# Altium project iMX53_BB_PCB_V1I1.PrjPcb (part 1 of 2)
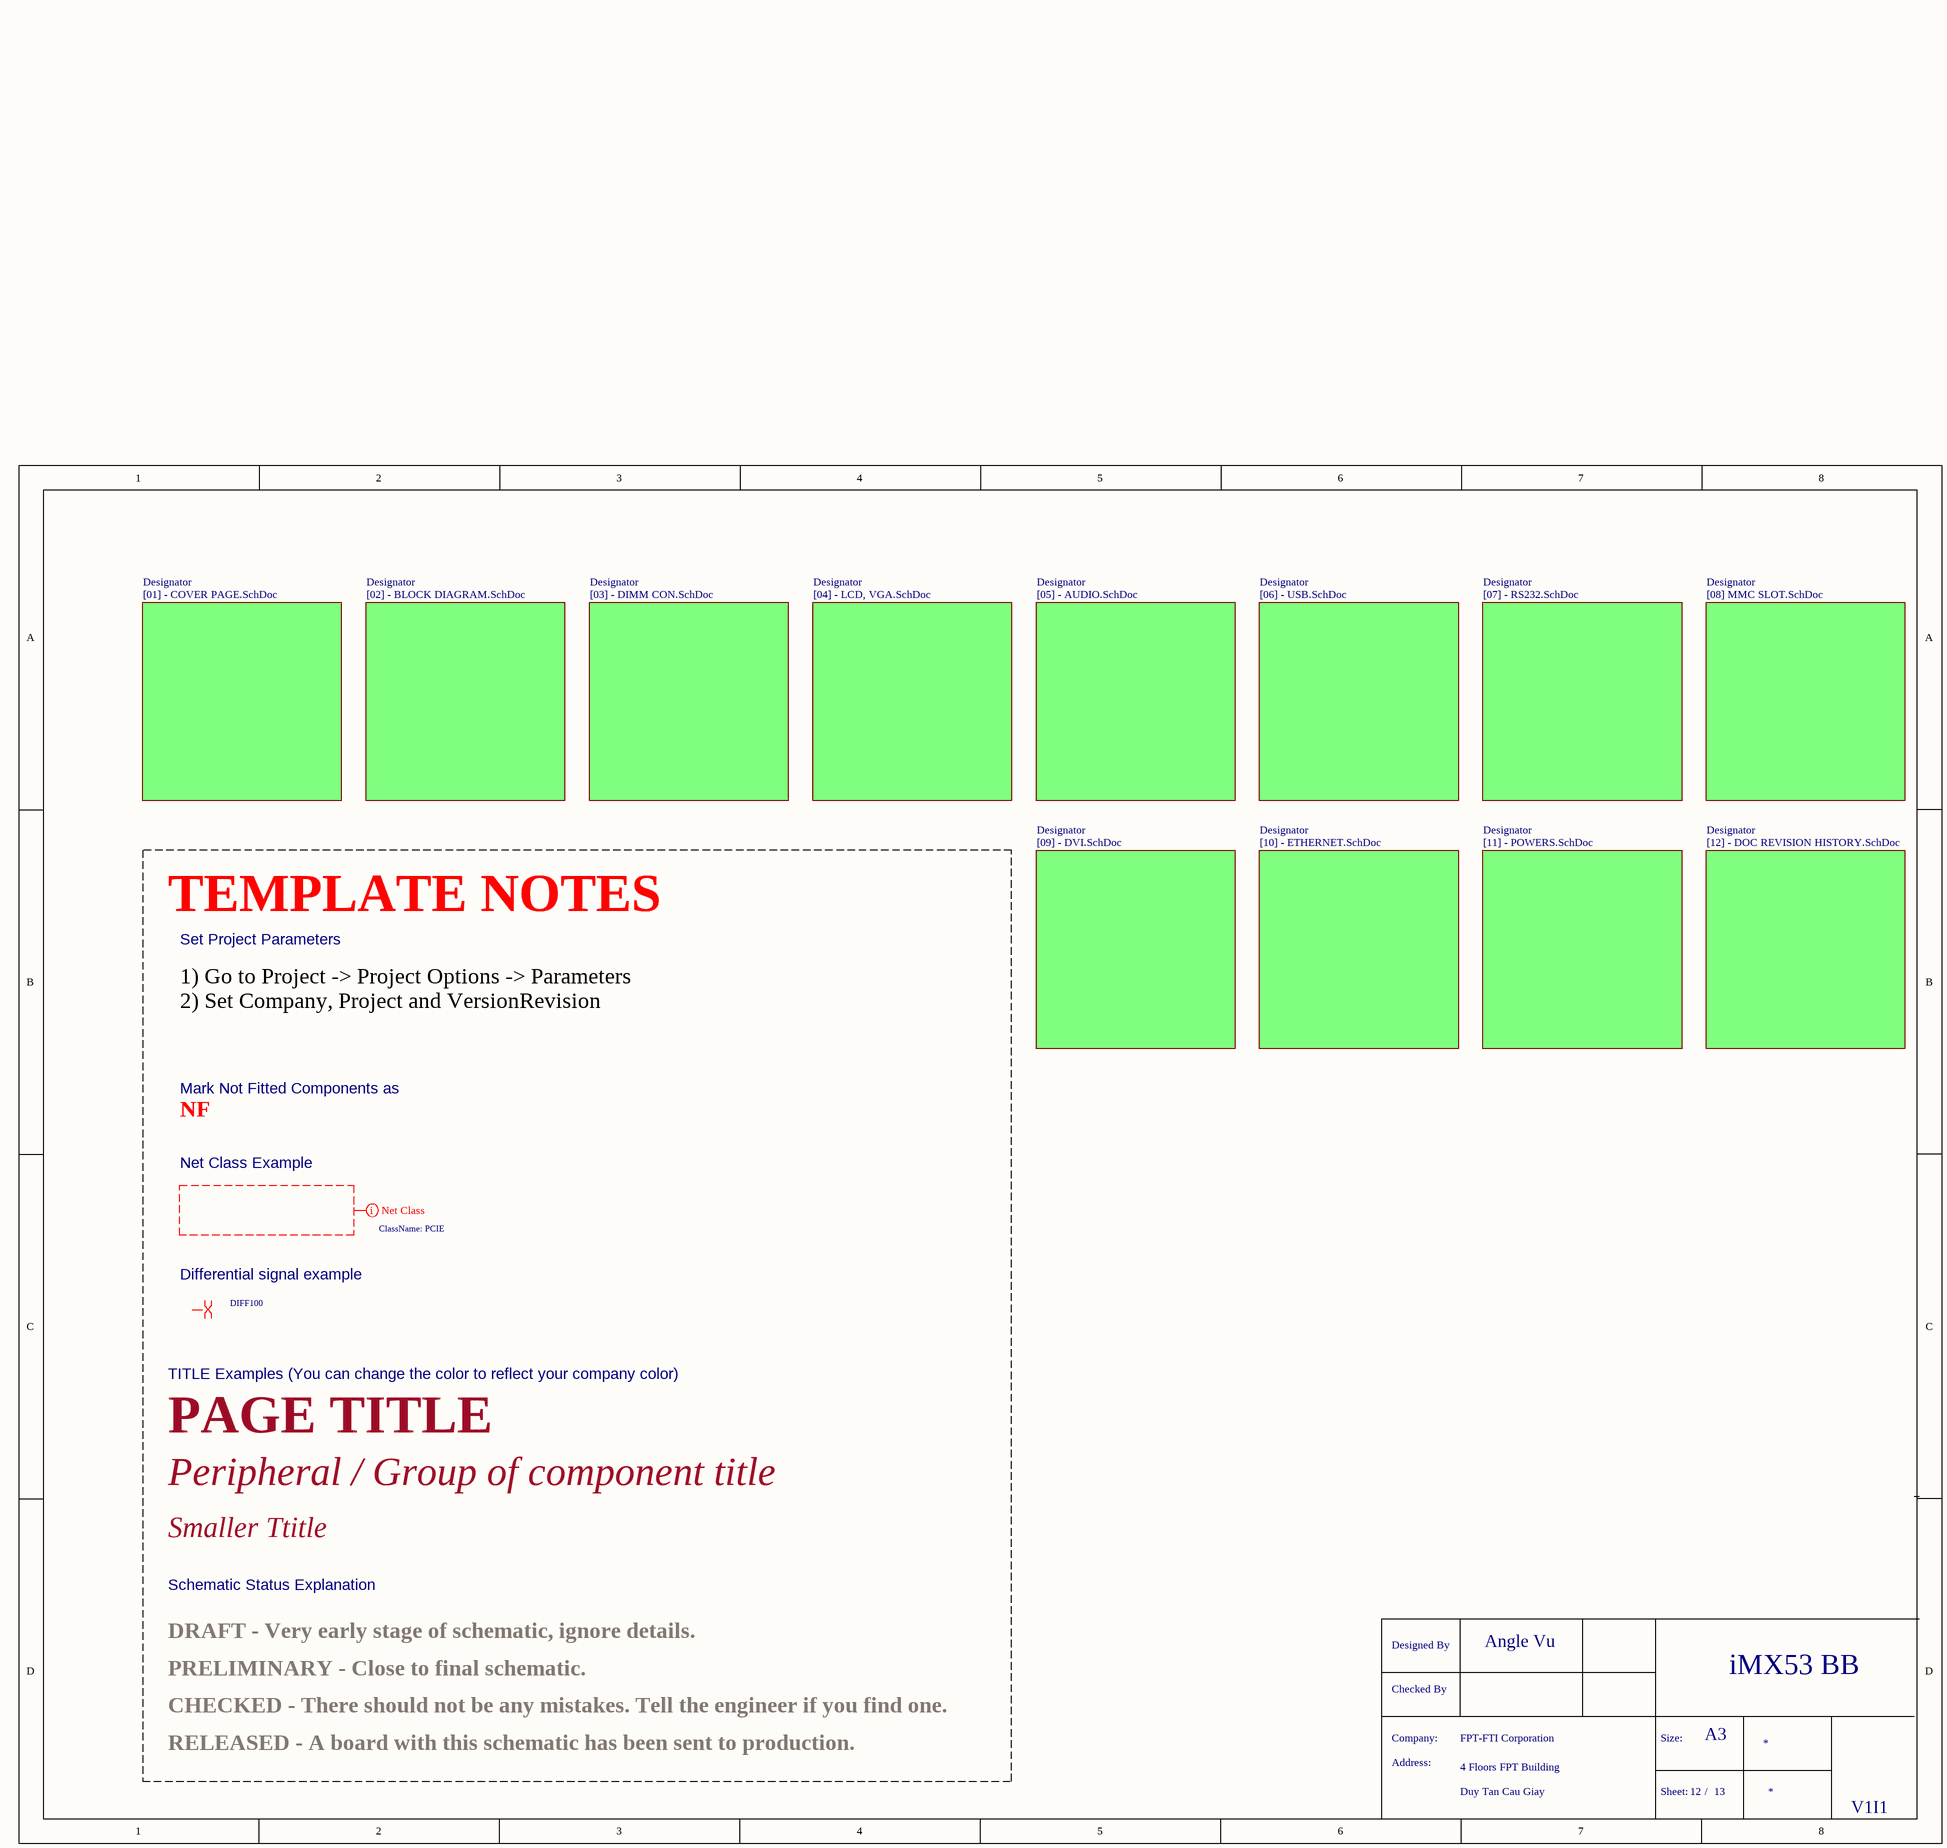
[diagram p0: iMX53 Base Board Project.SchDoc]
Version: V1I1; NameTitle: iMX53 BB; Company: (c) 2013 FEDEVEL www.fedevel.com; CName: FPT-FTI Corporation; addressName2: Duy Tan Cau Giay; addressName1: 4 Floors FPT Building
13 sheets, 582 parts. Net scope: flat (ports and power ports of the same name join across sheets).
Board file: iMX53_BB_PCB_V1I1.PcbDoc
Sheets:
  iMX53 Base Board Project.SchDoc
    Designator = [01] - COVER PAGE.SchDoc
    Designator = [02] - BLOCK DIAGRAM.SchDoc
    Designator = [03] - DIMM CON.SchDoc
    Designator = [04] - LCD, VGA.SchDoc
    Designator = [05] - AUDIO.SchDoc
    Designator = [06] - USB.SchDoc
    Designator = [07] - RS232.SchDoc
    Designator = [08] MMC SLOT.SchDoc
    Designator = [09] - DVI.SchDoc
    Designator = [10] - ETHERNET.SchDoc
    Designator = [11] - POWERS.SchDoc
    Designator = [12] - DOC REVISION HISTORY.SchDoc

## Sheet iMX53 Base Board Project.SchDoc
size A3; PageSetup: Record=PageOptions|CenterHorizontal=True|CenterVertical=True|PrintScale=1.07|XCorrection=1.00|YCorrection=1.00|PrintKind=1|BorderSize=5000000|LeftOffset=0|BottomOffset=0|Orientation=2|PaperLength=1000|PaperWidth=1000|Scale=100|PaperSource=7|PrintQuality=600|MediaType=1|DitherType=10|PaperKind=A3|PrintScaleMode=1; CompanyName: FPT-FTI copporation; Address1: FPT Building Duy Tan; Address2: Floor 4,; DocumentNumber: 12; SheetNumber: 12; SheetTotal: 13; NameAuthor: Angle Vu

### Sub-sheets
Designator = [01] - COVER PAGE.SchDoc: no entries
Designator = [02] - BLOCK DIAGRAM.SchDoc: no entries
Designator = [03] - DIMM CON.SchDoc: no entries
Designator = [04] - LCD, VGA.SchDoc: no entries
Designator = [05] - AUDIO.SchDoc: no entries
Designator = [06] - USB.SchDoc: no entries
Designator = [07] - RS232.SchDoc: no entries
Designator = [08] MMC SLOT.SchDoc: no entries
Designator = [09] - DVI.SchDoc: no entries
Designator = [10] - ETHERNET.SchDoc: no entries
Designator = [11] - POWERS.SchDoc: no entries
Designator = [12] - DOC REVISION HISTORY.SchDoc: no entries

### Layout directives
net class PCIE: (no net found under the mark)
differential pair; net class DIFF100: (no net found under the mark)

### Notes on the sheet
- TEMPLATE NOTES
- Set Project Parameters
- 1) Go to Project -> Project Options -> Parameters
  2) Set Company, Project and VersionRevision
- NF
- Mark Not Fitted Components as
- Net Class Example
- Differential signal example
- TITLE Examples (You can change the color to reflect your company color)
- PAGE TITLE
- Peripheral / Group of component title
- Smaller Ttitle
- Schematic Status Explanation
- PRELIMINARY - Close to final schematic.
- DRAFT - Very early stage of schematic, ignore details.
- CHECKED - There should not be any mistakes. Tell the engineer if you find one.
- RELEASED - A board with this schematic has been sent to production.
- Designed By
- Checked By
- Company:
- Size:
- A3
- Address:
- Sheet:
- /

## Sheet [01] - COVER PAGE.SchDoc
size A3; CompanyName: FPT-FTI copporation; Address1: FPT Building Duy Tan; Address2: Floor 4,; DocumentNumber: 1; SheetNumber: 1; SheetTotal: 13; NameAuthor: Angle Vu
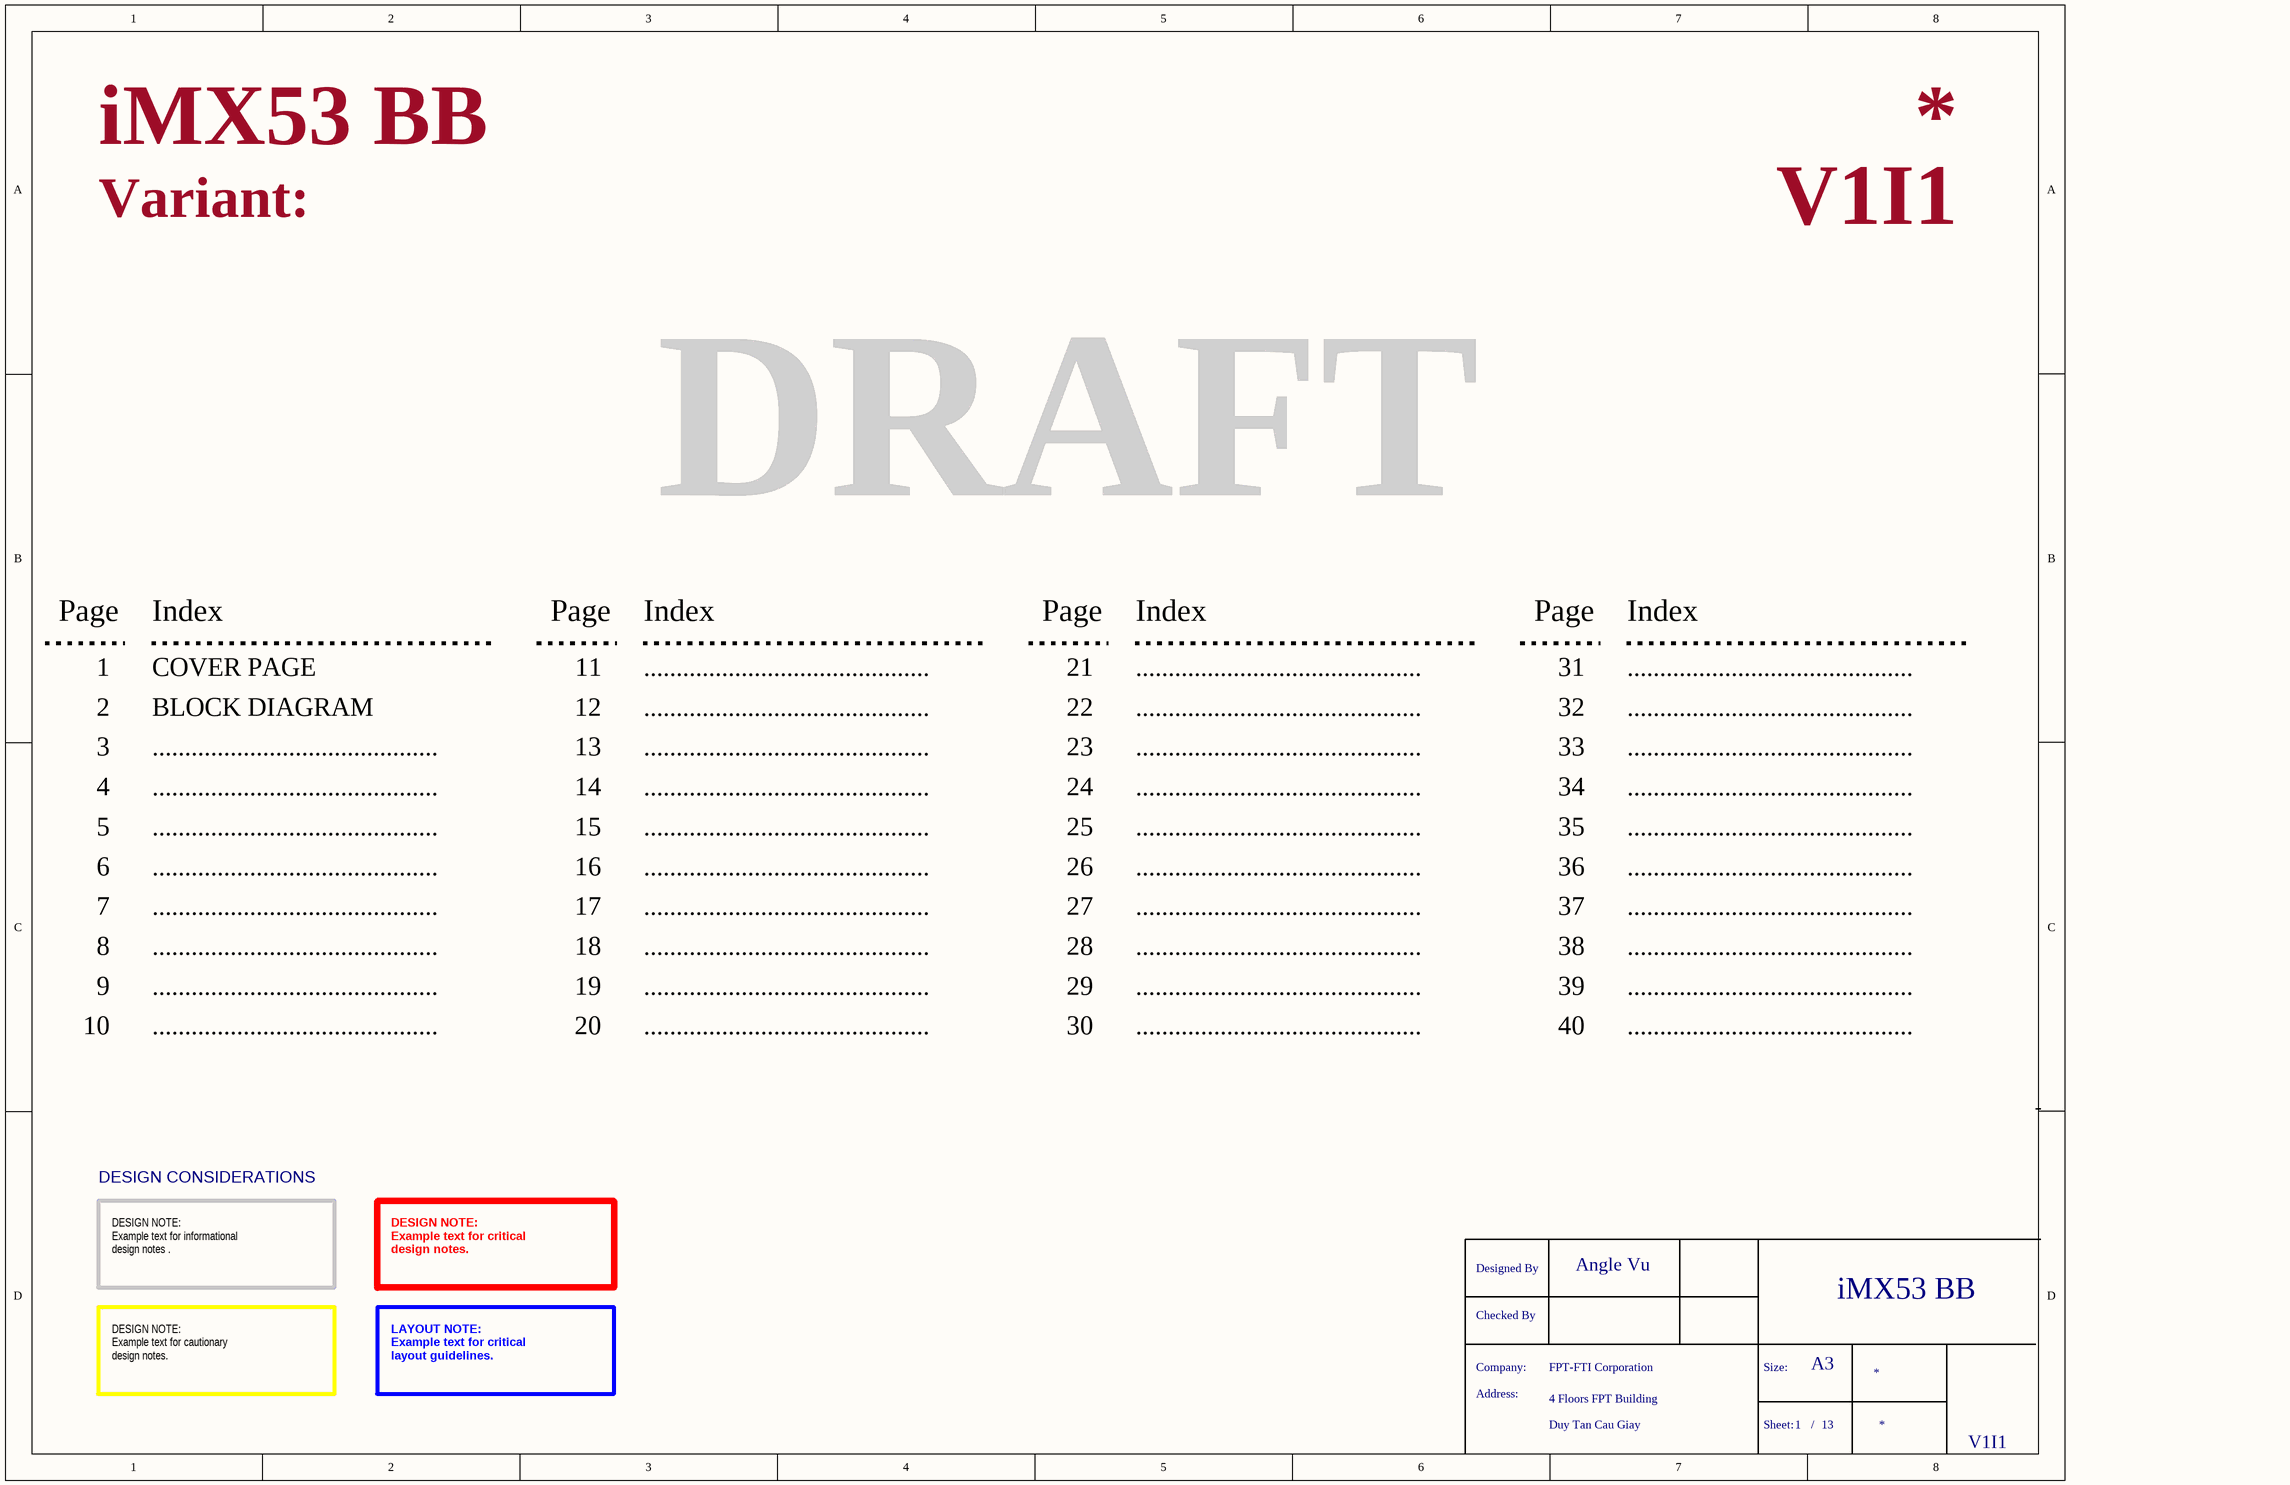
[diagram p1: [01] - COVER PAGE.SchDoc]

### Notes on the sheet
- Variant:
- DRAFT
- Page
- Index
- 1
- COVER PAGE
- 11
- ............................................
- 21
- 31
- 2
- 3
- BLOCK DIAGRAM
- 12
- 13
- 22
- 23
- 32
- 33
- 4
- 5
- 14
- 15
- 24
- 25
- 34
- 35
- 6
- 16
- 26
- 36
- 7
- 8
- 17
- 18
- 27
- 28
- 37
- 38
- 9
- 10
- 19
- 20
- 29
- 30
- 39
- 40
- DESIGN CONSIDERATIONS
- DESIGN NOTE:
  Example text for informational
  design notes .
- DESIGN NOTE:
  Example text for critical
  design notes.
- DESIGN NOTE:
  Example text for cautionary
  design notes.
- LAYOUT NOTE:
  Example text for critical
  layout guidelines.
- Designed By
- Checked By
- Company:
- Size:
- A3
- Address:
- Sheet:
- /

## Sheet [02] - BLOCK DIAGRAM.SchDoc
size A3; CompanyName: FPT-FTI copporation; Address1: FPT Building Duy Tan; Address2: Floor 4,; DocumentNumber: 2; SheetNumber: 2; SheetTotal: 13; NameAuthor: Angle Vu
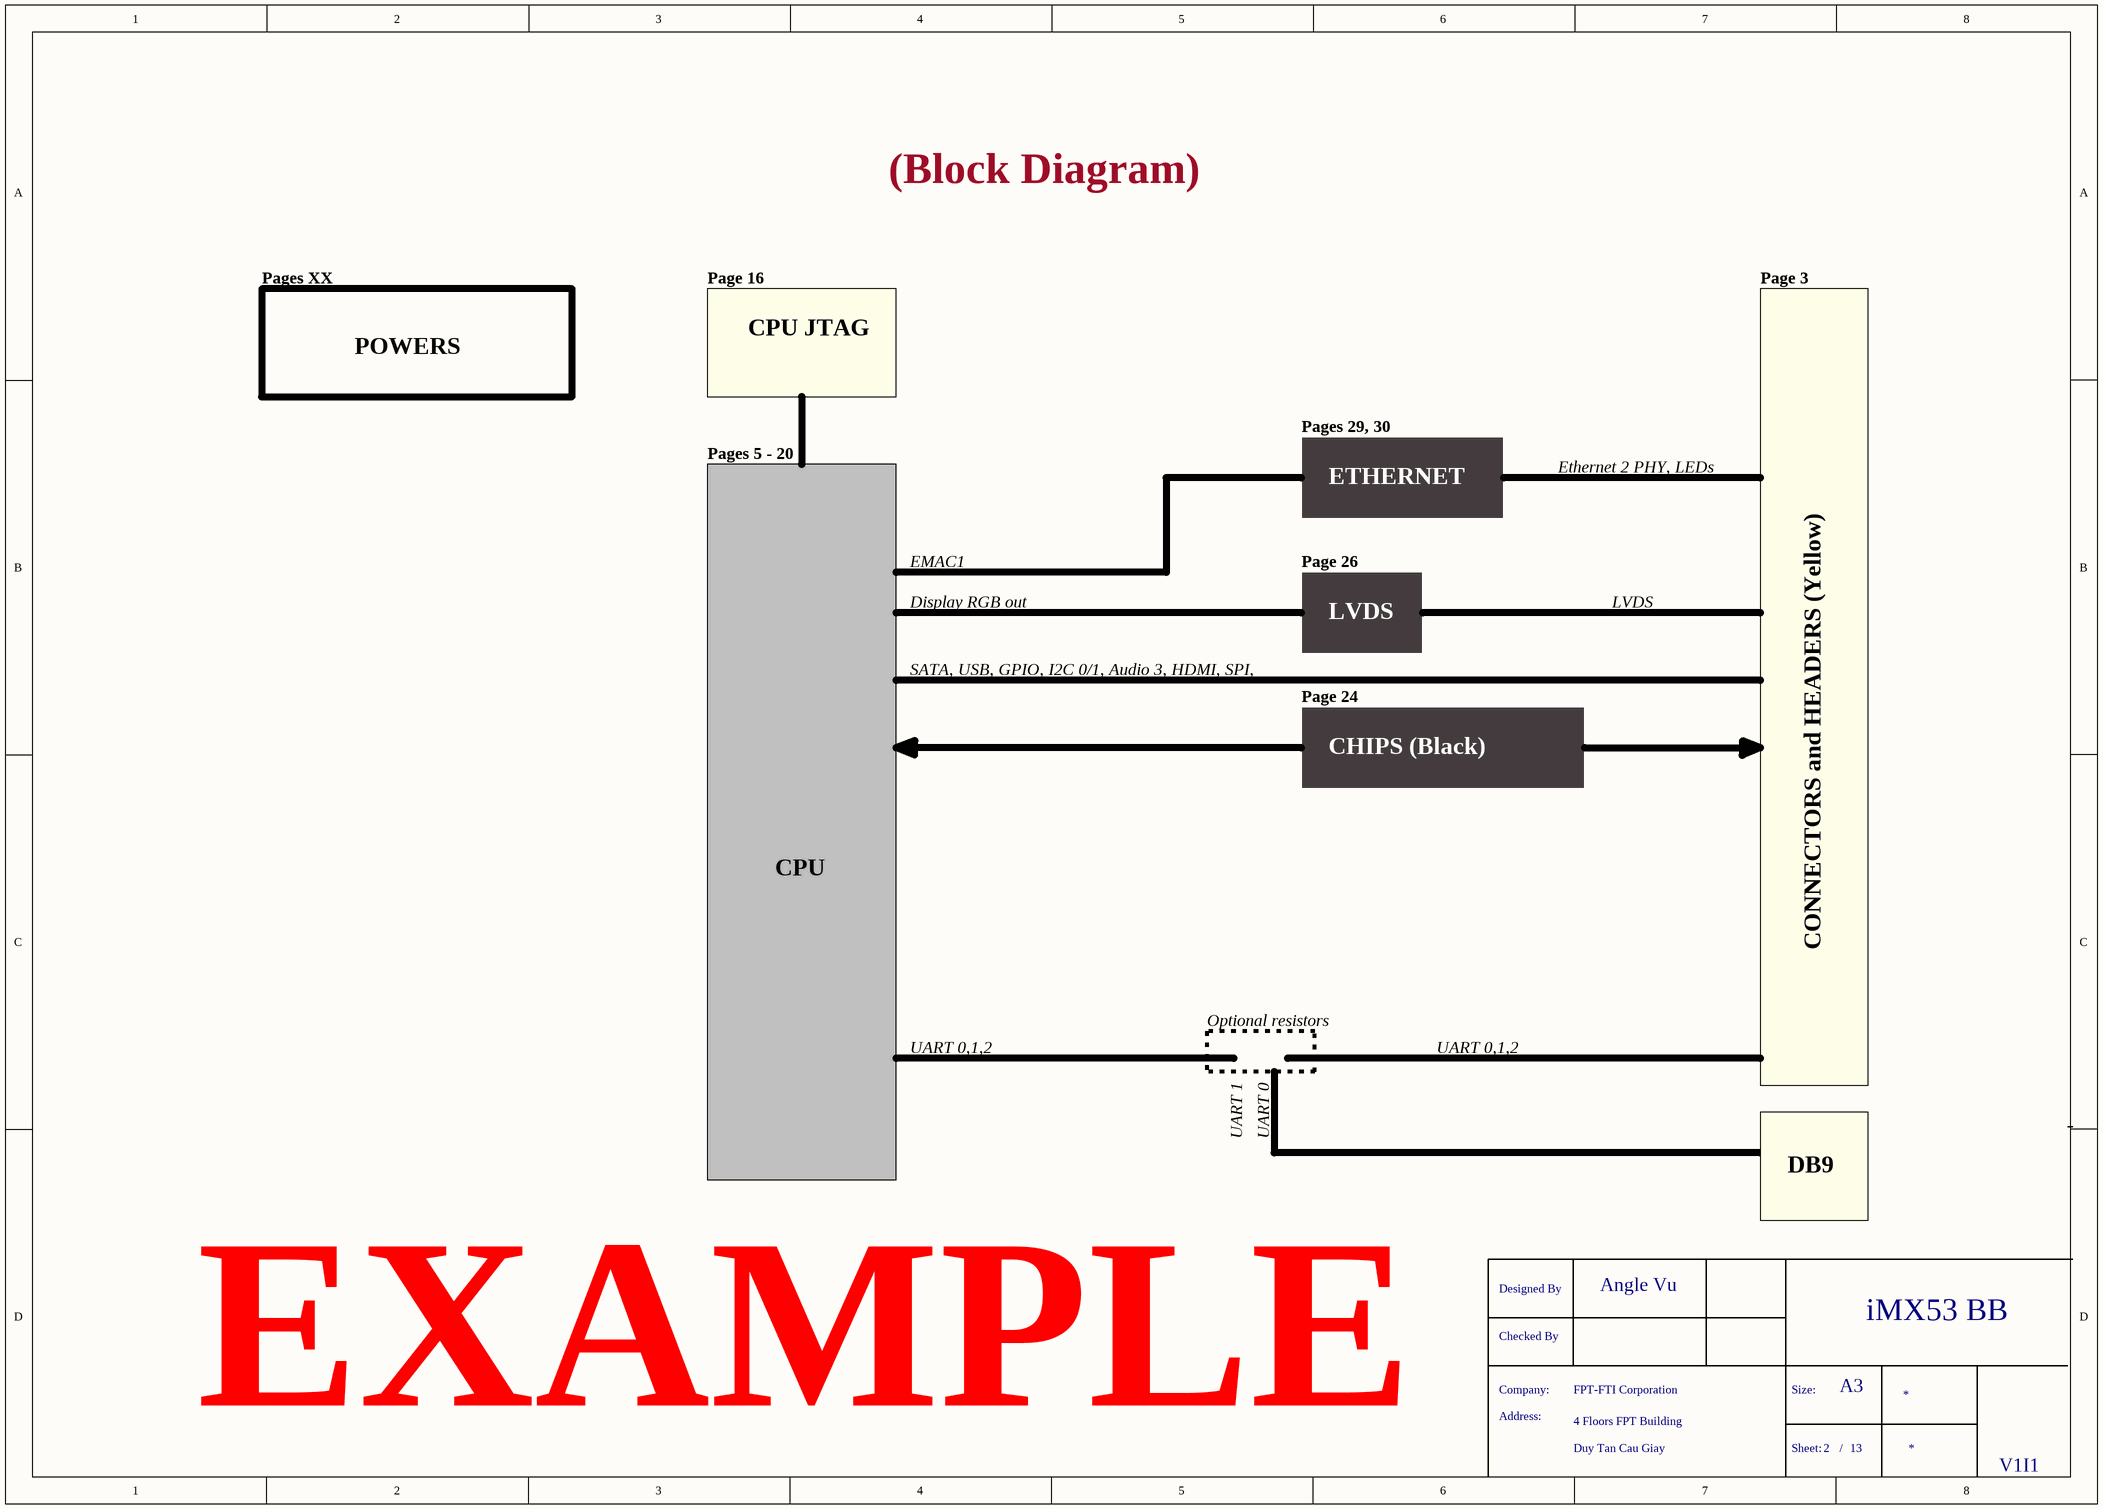
[diagram p2: [02] - BLOCK DIAGRAM.SchDoc]

### Notes on the sheet
- (Block Diagram)
- Pages XX
- Page 16
- Page 3
- POWERS
- CPU JTAG
- Pages 29, 30
- Pages 5 - 20
- ETHERNET
- Ethernet 2 PHY, LEDs
- EMAC1
- Page 26
- Display RGB out
- LVDS
- SATA, USB, GPIO, I2C 0/1, Audio 3, HDMI, SPI,
- Page 24
- CHIPS (Black)
- CPU
- CONNECTORS and HEADERS (Yellow)
- UART 0,1,2
- Optional resistors
- FPGA
- UART 1
- UART 0
- DB9
- CLOCKS (CPU & PCIE)
- EXAMPLE
- Designed By
- Checked By
- Company:
- Size:
- A3
- Address:
- Sheet:
- /

## Sheet [03] - DIMM CON.SchDoc
size A3; CompanyName: FPT-FTI copporation; Address1: FPT Building Duy Tan; Address2: Floor 4,; DocumentNumber: 3; SheetNumber: 3; SheetTotal: 13; NameAuthor: Angle Vu
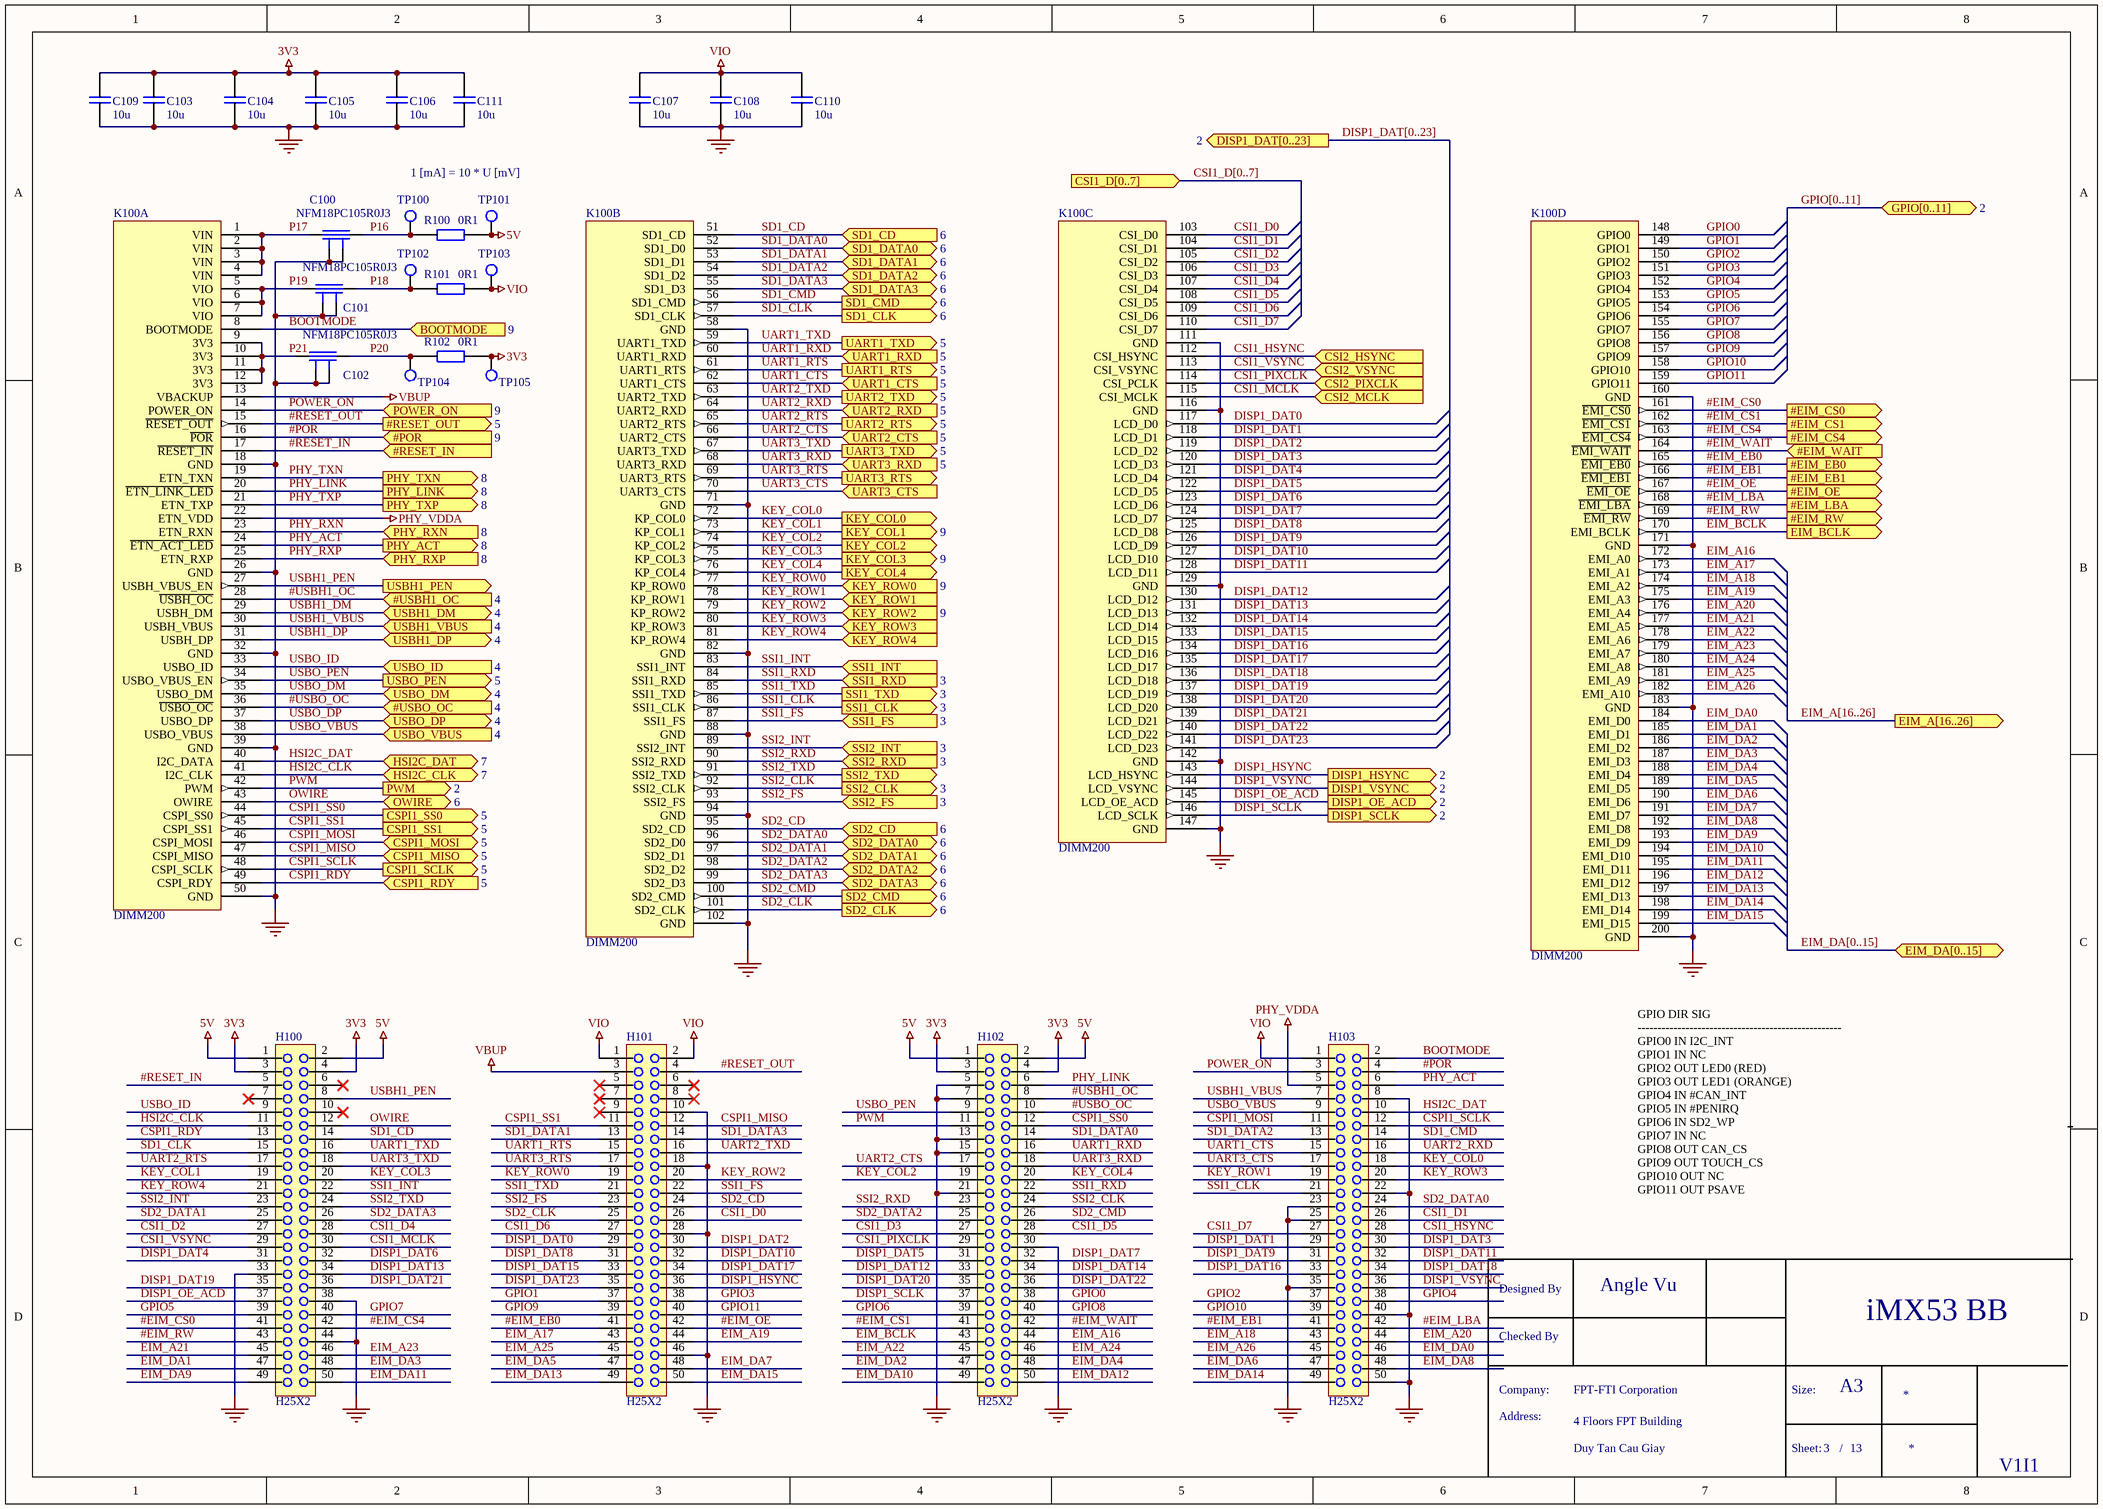
[diagram p3: [03] - DIMM CON.SchDoc]

### Parts
C100  NFM18PC105R0J3  [NFM18P]
C101  NFM18PC105R0J3  [NFM18P]
C102  NFM18PC105R0J3  [NFM18P]
C103  10u  [0805]
C104  10u  [0805]
C105  10u  [0805]
C106  10u  [0805]
C107  10u  [0805]
C108  10u  [0805]
C109  10u  [0805]
C110  10u  [0805]
C111  10u  [0805]
H100  H25X2  [H2x25]
H101  H25X2  [H2x25]
H102  H25X2  [H2x25]
H103  H25X2  [H2x25]
K100  DIMM200  [SODIMM200EDGE]  (parts A,B,C,D of 4)
R100  0R1  [0603]
R101  0R1  [0603]
R102  0R1  [0603]
TP100  TESTPOINT  [TESTPOINT_2mm]  (value not drawn)
TP101  TESTPOINT  [TESTPOINT_2mm]  (value not drawn)
TP102  TESTPOINT  [TESTPOINT_2mm]  (value not drawn)
TP103  TESTPOINT  [TESTPOINT_2mm]  (value not drawn)
TP104  TESTPOINT  [TESTPOINT_2mm]  (value not drawn)
TP105  TESTPOINT  [TESTPOINT_2mm]  (value not drawn)

### Ports
#EIM_CS0 (out), #EIM_CS1 (out), #EIM_CS4 (out), #EIM_EB0 (out), #EIM_EB1 (out), #EIM_LBA (out), #EIM_OE (out), #EIM_RW (out), #EIM_WAIT (in), #POR (in, see 9), #RESET_IN (in), #RESET_OUT (out, see 5), #USBH1_OC (in, see 4), #USBO_OC (in, see 4), BOOTMODE (in, see 9), CSI1_D[0..7] (in), CSI2_HSYNC (in), CSI2_MCLK (in), CSI2_PIXCLK (in), CSI2_VSYNC (in), CSPI1_MISO (bidir, see 5), CSPI1_MOSI (bidir, see 5), CSPI1_RDY (in, see 5), CSPI1_SCLK (out, see 5), CSPI1_SS0 (out, see 5), CSPI1_SS1 (out, see 5), DISP1_DAT[0..23] (out, see 2), DISP1_HSYNC (out, see 2), DISP1_OE_ACD (out, see 2), DISP1_SCLK (out, see 2), DISP1_VSYNC (out, see 2), EIM_A[16..26] (out), EIM_BCLK (out), EIM_DA[0..15] (bidir), GPIO[0..11] (bidir, see 2), HSI2C_CLK (bidir, see 7), HSI2C_DAT (bidir, see 7), KEY_COL0 (out), KEY_COL1 (out, see 9), KEY_COL2 (out), KEY_COL3 (out, see 9), KEY_COL4 (out), KEY_ROW0 (in, see 9), KEY_ROW1 (in), KEY_ROW2 (in, see 9), KEY_ROW3 (in), KEY_ROW4 (in), OWIRE (bidir, see 6), PHY_ACT (out, see 8), PHY_LINK (out, see 8), PHY_RXN (in, see 8), PHY_RXP (in, see 8), PHY_TXN (out, see 8), PHY_TXP (out, see 8), POWER_ON (in, see 9), PWM (out, see 2), SD1_CD (in, see 6), SD1_CLK (out, see 6), SD1_CMD (out, see 6), SD1_DATA0 (bidir, see 6), SD1_DATA1 (bidir, see 6), SD1_DATA2 (bidir, see 6), SD1_DATA3 (bidir, see 6), SD2_CD (in, see 6), SD2_CLK (out, see 6), SD2_CMD (out, see 6), SD2_DATA0 (bidir, see 6), SD2_DATA1 (bidir, see 6), SD2_DATA2 (bidir, see 6), SD2_DATA3 (bidir, see 6), SSI1_CLK (out, see 3), SSI1_FS (in, see 3), SSI1_INT (in), SSI1_RXD (in, see 3), SSI1_TXD (out, see 3), SSI2_CLK (out, see 3), SSI2_FS (in, see 3), SSI2_INT (in, see 3), SSI2_RXD (in, see 3), SSI2_TXD (out), UART1_CTS (in, see 5), UART1_RTS (out, see 5), UART1_RXD (in, see 5), UART1_TXD (out, see 5), UART2_CTS (in, see 5), UART2_RTS (out, see 5), UART2_RXD (in, see 5), UART2_TXD (out, see 5), UART3_CTS (in), UART3_RTS (out), UART3_RXD (in, see 5), UART3_TXD (out, see 5), USBH1_DM (bidir, see 4), USBH1_DP (bidir, see 4), USBH1_PEN (out), USBH1_VBUS (in, see 4), USBO_DM (bidir, see 4), USBO_DP (bidir, see 4), USBO_ID (in, see 4), USBO_PEN (out, see 5), USBO_VBUS (in, see 4)

### Nets
3V3: C103.2 C104.2 C105.2 C106.2 C109.2 C111.2 H100.3 H100.4 H102.3 H102.4 R102.2 TP105.1
5V: H100.1 H100.2 H102.1 H102.2 R100.2 TP101.1
GND: C100.2 C100.4 C101.2 C101.4 C102.2 C102.4 C103.1 C104.1 C105.1 C106.1 C107.1 C108.1 C109.1 C110.1 C111.1 H100.33 H100.38 H100.44 H101.10 H101.18 H101.28 H101.46 H102.5 H102.7 H102.13 H102.15 H102.21 H102.30 H103.8 H103.22 H103.23 H103.25 H103.35 H103.40 H103.50 K100.18(GND) K100.26(GND) K100.32(GND) K100.39(GND) K100.50(GND) K100.58(GND) K100.71(GND) K100.82(GND) K100.88(GND) K100.94(GND) K100.102(GND) K100.111(GND) K100.116(GND) K100.129(GND) K100.142(GND) K100.147(GND) K100.160(GND) K100.171(GND) K100.183(GND) K100.200(GND)
PHY_VDDA: H103.5 K100.22(ETN_VDD)
VBUP: H101.3 K100.13(VBACKUP)
VIO: C107.2 C108.2 C110.2 H101.1 H101.2 H103.1 R101.2 TP103.1
#EIM_CS0: H100.41 K100.161(~{EMI_CS0}) ; port #EIM_CS0
#EIM_CS1: H102.41 K100.162(~{EMI_CS1}) ; port #EIM_CS1
#EIM_CS4: H100.42 K100.163(~{EMI_CS4}) ; port #EIM_CS4
#EIM_EB0: H101.41 K100.165(~{EMI_EB0}) ; port #EIM_EB0
#EIM_EB1: H103.41 K100.166(~{EMI_EB1}) ; port #EIM_EB1
#EIM_LBA: H103.42 K100.168(~{EMI_LBA}) ; port #EIM_LBA
#EIM_OE: H101.42 K100.167(~{EMI_OE}) ; port #EIM_OE
#EIM_RW: H100.43 K100.169(~{EMI_RW}) ; port #EIM_RW
#EIM_WAIT: H102.42 K100.164(~{EMI_WAIT}) ; port #EIM_WAIT
#POR: H103.4 K100.16(~{POR}) ; port #POR
#RESET_IN: H100.5 K100.17(~{RESET_IN}) ; port #RESET_IN
#RESET_OUT: H101.4 K100.15(~{RESET_OUT}) ; port #RESET_OUT
#USBH1_OC: H102.8 K100.28(~{USBH_OC}) ; port #USBH1_OC
#USBO_OC: H102.10 K100.36(~{USBO_OC}) ; port #USBO_OC
BOOTMODE: H103.2 K100.8(BOOTMODE) ; port BOOTMODE
CSI1_D0: H101.26 K100.103(CSI_D0)
CSI1_D1: H103.26 K100.104(CSI_D1)
CSI1_D2: H100.27 K100.105(CSI_D2)
CSI1_D3: H102.27 K100.106(CSI_D3)
CSI1_D4: H100.28 K100.107(CSI_D4)
CSI1_D5: H102.28 K100.108(CSI_D5)
CSI1_D6: H101.27 K100.109(CSI_D6)
CSI1_D7: H103.27 K100.110(CSI_D7)
CSI1_HSYNC: H103.28 K100.112(CSI_HSYNC) ; port CSI2_HSYNC
CSI1_MCLK: H100.30 K100.115(CSI_MCLK) ; port CSI2_MCLK
CSI1_PIXCLK: H102.29 K100.114(CSI_PCLK) ; port CSI2_PIXCLK
CSI1_VSYNC: H100.29 K100.113(CSI_VSYNC) ; port CSI2_VSYNC
CSPI1_MISO: H101.12 K100.47(CSPI_MISO) ; port CSPI1_MISO
CSPI1_MOSI: H103.11 K100.46(CSPI_MOSI) ; port CSPI1_MOSI
CSPI1_RDY: H100.13 K100.49(CSPI_RDY) ; port CSPI1_RDY
CSPI1_SCLK: H103.12 K100.48(CSPI_SCLK) ; port CSPI1_SCLK
CSPI1_SS0: H102.12 K100.44(CSPI_SS0) ; port CSPI1_SS0
CSPI1_SS1: H101.11 K100.45(CSPI_SS1) ; port CSPI1_SS1
DISP1_DAT0: H101.29 K100.117(LCD_D0)
DISP1_DAT1: H103.29 K100.118(LCD_D1)
DISP1_DAT2: H101.30 K100.119(LCD_D2)
DISP1_DAT3: H103.30 K100.120(LCD_D3)
DISP1_DAT4: H100.31 K100.121(LCD_D4)
DISP1_DAT5: H102.31 K100.122(LCD_D5)
DISP1_DAT6: H100.32 K100.123(LCD_D6)
DISP1_DAT7: H102.32 K100.124(LCD_D7)
DISP1_DAT8: H101.31 K100.125(LCD_D8)
DISP1_DAT9: H103.31 K100.126(LCD_D9)
DISP1_DAT10: H101.32 K100.127(LCD_D10)
DISP1_DAT11: H103.32 K100.128(LCD_D11)
DISP1_DAT12: H102.33 K100.130(LCD_D12)
DISP1_DAT13: H100.34 K100.131(LCD_D13)
DISP1_DAT14: H102.34 K100.132(LCD_D14)
DISP1_DAT15: H101.33 K100.133(LCD_D15)
DISP1_DAT16: H103.33 K100.134(LCD_D16)
DISP1_DAT17: H101.34 K100.135(LCD_D17)
DISP1_DAT18: H103.34 K100.136(LCD_D18)
DISP1_DAT19: H100.35 K100.137(LCD_D19)
DISP1_DAT20: H102.35 K100.138(LCD_D20)
DISP1_DAT21: H100.36 K100.139(LCD_D21)
DISP1_DAT22: H102.36 K100.140(LCD_D22)
DISP1_DAT23: H101.35 K100.141(LCD_D23)
DISP1_HSYNC: H101.36 K100.143(LCD_HSYNC) ; port DISP1_HSYNC
DISP1_OE_ACD: H100.37 K100.145(LCD_OE_ACD) ; port DISP1_OE_ACD
DISP1_SCLK: H102.37 K100.146(LCD_SCLK) ; port DISP1_SCLK
DISP1_VSYNC: H103.36 K100.144(LCD_VSYNC) ; port DISP1_VSYNC
EIM_A16: H102.44 K100.172(EMI_A0)
EIM_A17: H101.43 K100.173(EMI_A1)
EIM_A18: H103.43 K100.174(EMI_A2)
EIM_A19: H101.44 K100.175(EMI_A3)
EIM_A20: H103.44 K100.176(EMI_A4)
EIM_A21: H100.45 K100.177(EMI_A5)
EIM_A22: H102.45 K100.178(EMI_A6)
EIM_A23: H100.46 K100.179(EMI_A7)
EIM_A24: H102.46 K100.180(EMI_A8)
EIM_A25: H101.45 K100.181(EMI_A9)
EIM_A26: H103.45 K100.182(EMI_A10)
EIM_BCLK: H102.43 K100.170(EMI_BCLK) ; port EIM_BCLK
EIM_DA0: H103.46 K100.184(EMI_D0)
EIM_DA1: H100.47 K100.185(EMI_D1)
EIM_DA2: H102.47 K100.186(EMI_D2)
EIM_DA3: H100.48 K100.187(EMI_D3)
EIM_DA4: H102.48 K100.188(EMI_D4)
EIM_DA5: H101.47 K100.189(EMI_D5)
EIM_DA6: H103.47 K100.190(EMI_D6)
EIM_DA7: H101.48 K100.191(EMI_D7)
EIM_DA8: H103.48 K100.192(EMI_D8)
EIM_DA9: H100.49 K100.193(EMI_D9)
EIM_DA10: H102.49 K100.194(EMI_D10)
EIM_DA11: H100.50 K100.195(EMI_D11)
EIM_DA12: H102.50 K100.196(EMI_D12)
EIM_DA13: H101.49 K100.197(EMI_D13)
EIM_DA14: H103.49 K100.198(EMI_D14)
EIM_DA15: H101.50 K100.199(EMI_D15)
GPIO0: H102.38 K100.148(GPIO0)
GPIO1: H101.37 K100.149(GPIO1)
GPIO2: H103.37 K100.150(GPIO2)
GPIO3: H101.38 K100.151(GPIO3)
GPIO4: H103.38 K100.152(GPIO4)
GPIO5: H100.39 K100.153(GPIO5)
GPIO6: H102.39 K100.154(GPIO6)
GPIO7: H100.40 K100.155(GPIO7)
GPIO8: H102.40 K100.156(GPIO8)
GPIO9: H101.39 K100.157(GPIO9)
GPIO10: H103.39 K100.158(GPIO10)
GPIO11: H101.40 K100.159(GPIO11)
HSI2C_CLK: H100.11 K100.41(I2C_CLK) ; port HSI2C_CLK
HSI2C_DAT: H103.10 K100.40(I2C_DATA) ; port HSI2C_DAT
KEY_COL0: H103.18 K100.72(KP_COL0) ; port KEY_COL0
KEY_COL1: H100.19 K100.73(KP_COL1) ; port KEY_COL1
KEY_COL2: H102.19 K100.74(KP_COL2) ; port KEY_COL2
KEY_COL3: H100.20 K100.75(KP_COL3) ; port KEY_COL3
KEY_COL4: H102.20 K100.76(KP_COL4) ; port KEY_COL4
KEY_ROW0: H101.19 K100.77(KP_ROW0) ; port KEY_ROW0
KEY_ROW1: H103.19 K100.78(KP_ROW1) ; port KEY_ROW1
KEY_ROW2: H101.20 K100.79(KP_ROW2) ; port KEY_ROW2
KEY_ROW3: H103.20 K100.80(KP_ROW3) ; port KEY_ROW3
KEY_ROW4: H100.21 K100.81(KP_ROW4) ; port KEY_ROW4
OWIRE: H100.12 K100.43(OWIRE) ; port OWIRE
P16: C100.3 R100.1 TP100.1
P17: C100.1 K100.1(VIN) K100.2(VIN) K100.3(VIN) K100.4(VIN)
P18: C101.3 R101.1 TP102.1
P19: C101.1 K100.5(VIO) K100.6(VIO) K100.7(VIO)
P20: C102.3 R102.1 TP104.1
P21: C102.1 K100.9(3V3) K100.10(3V3) K100.11(3V3) K100.12(3V3)
PHY_ACT: H103.6 K100.24(~{ETN_ACT_LED}) ; port PHY_ACT
PHY_LINK: H102.6 K100.20(~{ETN_LINK_LED}) ; port PHY_LINK
PHY_RXN: K100.23(ETN_RXN) ; port PHY_RXN
PHY_RXP: K100.25(ETN_RXP) ; port PHY_RXP
PHY_TXN: K100.19(ETN_TXN) ; port PHY_TXN
PHY_TXP: K100.21(ETN_TXP) ; port PHY_TXP
POWER_ON: H103.3 K100.14(POWER_ON) ; port POWER_ON
PWM: H102.11 K100.42(PWM) ; port PWM
SD1_CD: H100.14 K100.51(SD1_CD) ; port SD1_CD
SD1_CLK: H100.15 K100.57(SD1_CLK) ; port SD1_CLK
SD1_CMD: H103.14 K100.56(SD1_CMD) ; port SD1_CMD
SD1_DATA0: H102.14 K100.52(SD1_D0) ; port SD1_DATA0
SD1_DATA1: H101.13 K100.53(SD1_D1) ; port SD1_DATA1
SD1_DATA2: H103.13 K100.54(SD1_D2) ; port SD1_DATA2
SD1_DATA3: H101.14 K100.55(SD1_D3) ; port SD1_DATA3
SD2_CD: H101.24 K100.95(SD2_CD) ; port SD2_CD
SD2_CLK: H101.25 K100.101(SD2_CLK) ; port SD2_CLK
SD2_CMD: H102.26 K100.100(SD2_CMD) ; port SD2_CMD
SD2_DATA0: H103.24 K100.96(SD2_D0) ; port SD2_DATA0
SD2_DATA1: H100.25 K100.97(SD2_D1) ; port SD2_DATA1
SD2_DATA2: H102.25 K100.98(SD2_D2) ; port SD2_DATA2
SD2_DATA3: H100.26 K100.99(SD2_D3) ; port SD2_DATA3
SSI1_CLK: H103.21 K100.86(SSI1_CLK) ; port SSI1_CLK
SSI1_FS: H101.22 K100.87(SSI1_FS) ; port SSI1_FS
SSI1_INT: H100.22 K100.83(SSI1_INT) ; port SSI1_INT
SSI1_RXD: H102.22 K100.84(SSI1_RXD) ; port SSI1_RXD
SSI1_TXD: H101.21 K100.85(SSI1_TXD) ; port SSI1_TXD
SSI2_CLK: H102.24 K100.92(SSI2_CLK) ; port SSI2_CLK
SSI2_FS: H101.23 K100.93(SSI2_FS) ; port SSI2_FS
SSI2_INT: H100.23 K100.89(SSI2_INT) ; port SSI2_INT
SSI2_RXD: H102.23 K100.90(SSI2_RXD) ; port SSI2_RXD
SSI2_TXD: H100.24 K100.91(SSI2_TXD) ; port SSI2_TXD
UART1_CTS: H103.15 K100.62(UART1_CTS) ; port UART1_CTS
UART1_RTS: H101.15 K100.61(UART1_RTS) ; port UART1_RTS
UART1_RXD: H102.16 K100.60(UART1_RXD) ; port UART1_RXD
UART1_TXD: H100.16 K100.59(UART1_TXD) ; port UART1_TXD
UART2_CTS: H102.17 K100.66(UART2_CTS) ; port UART2_CTS
UART2_RTS: H100.17 K100.65(UART2_RTS) ; port UART2_RTS
UART2_RXD: H103.16 K100.64(UART2_RXD) ; port UART2_RXD
UART2_TXD: H101.16 K100.63(UART2_TXD) ; port UART2_TXD
UART3_CTS: H103.17 K100.70(UART3_CTS) ; port UART3_CTS
UART3_RTS: H101.17 K100.69(UART3_RTS) ; port UART3_RTS
UART3_RXD: H102.18 K100.68(UART3_RXD) ; port UART3_RXD
UART3_TXD: H100.18 K100.67(UART3_TXD) ; port UART3_TXD
USBH1_DM: K100.29(USBH_DM) ; port USBH1_DM
USBH1_DP: K100.31(USBH_DP) ; port USBH1_DP
USBH1_PEN: H100.8 K100.27(USBH_VBUS_EN) ; port USBH1_PEN
USBH1_VBUS: H103.7 K100.30(USBH_VBUS) ; port USBH1_VBUS
USBO_DM: K100.35(USBO_DM) ; port USBO_DM
USBO_DP: K100.37(USBO_DP) ; port USBO_DP
USBO_ID: H100.9 K100.33(USBO_ID) ; port USBO_ID
USBO_PEN: H102.9 K100.34(USBO_VBUS_EN) ; port USBO_PEN
USBO_VBUS: H103.9 K100.38(USBO_VBUS) ; port USBO_VBUS

Not connected (* = marked no-connect by the designer): H100 6* 7* 10*; H101 5* 6* 7* 8* 9*

### Buses and harness runs
bus CSI1_D[0..7] = port CSI1_D[0..7]
bus DISP1_DAT[0..23] = port DISP1_DAT[0..23]
bus EIM_A[16..26] = port EIM_A[16..26]
bus EIM_DA[0..15] = port EIM_DA[0..15]
bus GPIO[0..11] = port GPIO[0..11]

### Notes on the sheet
- 1 [mA] = 10 * U [mV]
- GPIO	DIR	SIG
  ---------------------------------------------------
  GPIO0	IN	I2C_INT
  GPIO1	IN	NC
  GPIO2	OUT	LED0 (RED)
  GPIO3	OUT	LED1 (ORANGE)
  GPIO4	IN	#CAN_INT
  GPIO5	IN	#PENIRQ
  GPIO6	IN	SD2_WP
  GPIO7	IN	NC
  GPIO8	OUT	CAN_CS
  GPIO9	OUT	TOUCH_CS
  GPIO10	OUT	NC
  GPIO11	OUT	PSAVE
- Designed By
- Checked By
- Company:
- Size:
- A3
- Address:
- Sheet:
- /

### Library data of the parts
C100-C102 = NFL21S: Chip EMIFIL; Producer: Murata; Order number: NFM18PC105R0J3; Component class: C; Assembly type: SMT
C103-C111 = C
R100-R102 = R
TP100-TP105 = TESTPOINT: Testpoint pad; Order number: no component; Component class: TP; Producer: n/a; Assembly type: no component

## Sheet [04] - LCD, VGA.SchDoc
size A3; CompanyName: FPT-FTI copporation; Address1: FPT Building Duy Tan; Address2: Floor 4,; DocumentNumber: 4; SheetNumber: 4; SheetTotal: 13; NameAuthor: Angle Vu
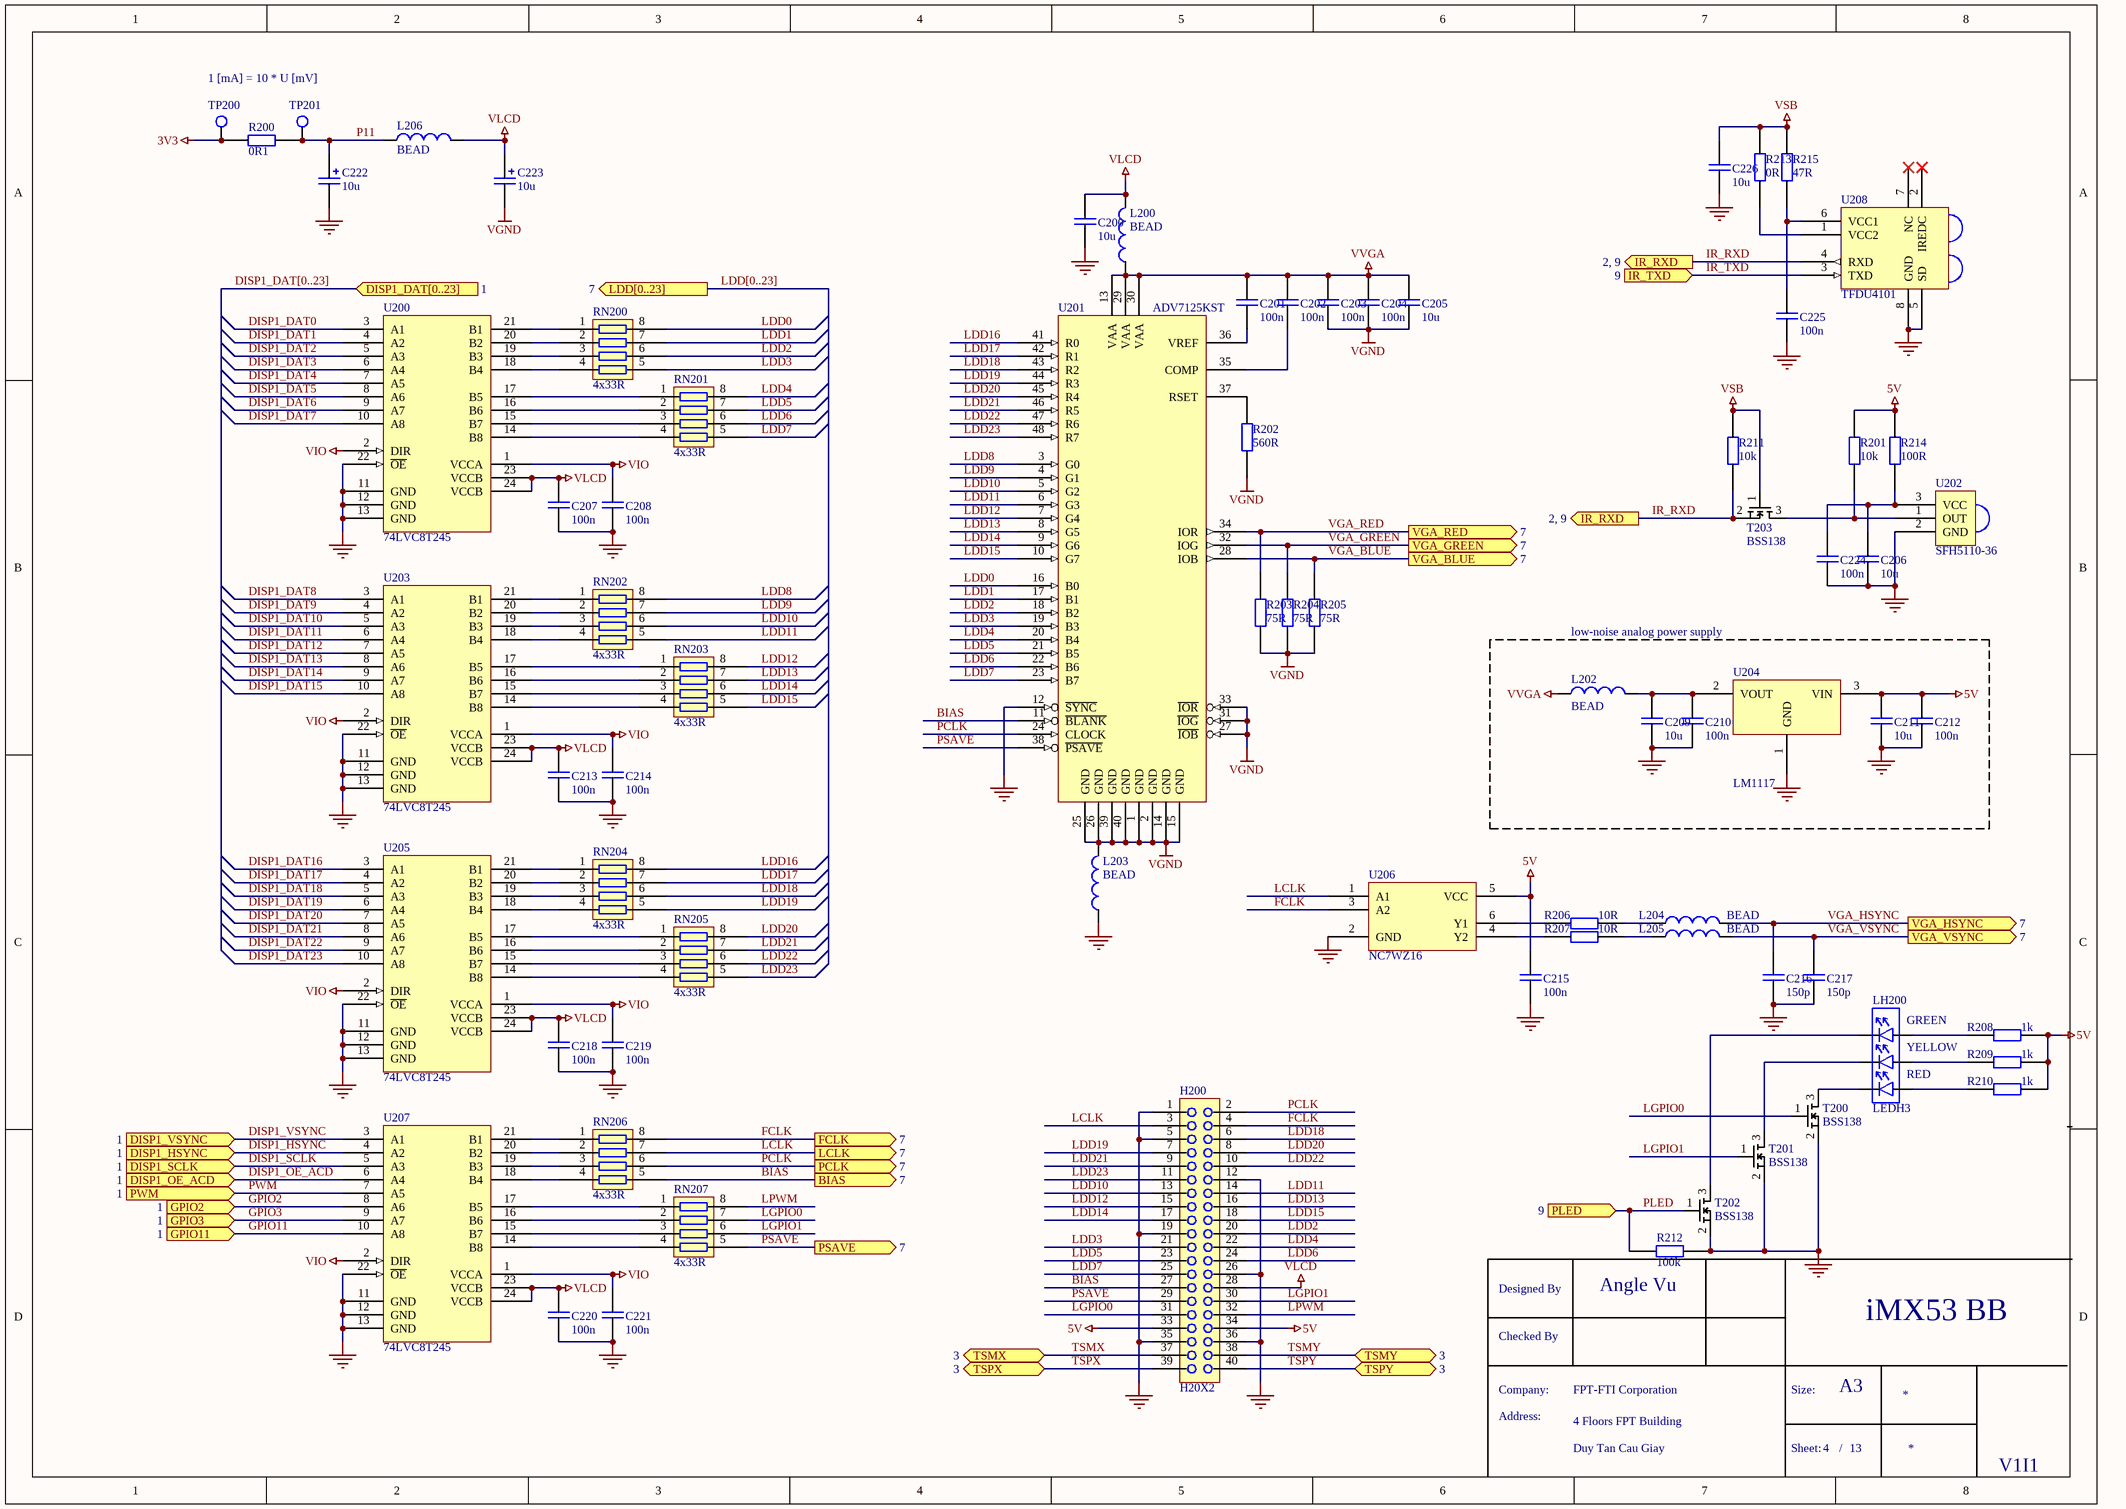
[diagram p4: [04] - LCD, VGA.SchDoc]

### Parts
C200  10u  [0805]
C201  100n  [0603]
C202  100n  [0603]
C203  100n  [0603]
C204  100n  [0603]
C205  10u  [0805]
C206  10u  [0805]
C207  100n  [0603]
C208  100n  [0603]
C209  10u  [0805]
C210  100n  [0603]
C211  10u  [0805]
C212  100n  [0603]
C213  100n  [0603]
C214  100n  [0603]
C215  100n  [0603]
C216  150p  [0603]
C217  150p  [0603]
C218  100n  [0603]
C219  100n  [0603]
C220  100n  [0603]
C221  100n  [0603]
C222  10u  [3216A]
C223  10u  [3216A]
C224  100n  [0603]
C225  100n  [0603]
C226  10u  [0805]
H200  H20X2  [H2x20]
L200  BEAD  [0603]
L202  BEAD  [0603]
L203  BEAD  [0603]
L204  BEAD  [0603]
L205  BEAD  [0603]
L206  BEAD  [0603]
LH200  LEDH3  [LED HOLDER 3]
R200  0R1  [0603]
R201  10k  [0603]
R202  560R  [0603]
R203  75R  [0603]
R204  75R  [0603]
R205  75R  [0603]
R206  10R  [0603]
R207  10R  [0603]
R208  1k  [0603]
R209  1k  [0603]
R210  1k  [0603]
R211  10k  [0603]
R212  100k  [0603]
R213  0R  [0603]
R214  100R  [0603]
R215  47R  [0603]
RN200  4x33R  [RX4_NS]
RN201  4x33R  [RX4_NS]
RN202  4x33R  [RX4_NS]
RN203  4x33R  [RX4_NS]
RN204  4x33R  [RX4_NS]
RN205  4x33R  [RX4_NS]
RN206  4x33R  [RX4_NS]
RN207  4x33R  [RX4_NS]
T200  BSS138  [SOT23]
T201  BSS138  [SOT23]
T202  BSS138  [SOT23]
T203  BSS138  [SOT23]
TP200  TESTPOINT  [TESTPOINT_2mm]  (value not drawn)
TP201  TESTPOINT  [TESTPOINT_2mm]  (value not drawn)
U200  74LVC8T245  [TSSOP24]
U201  ADV7125KST  [LQFP48]
U202  SFH5110-36  [SFH511x]
U203  74LVC8T245  [TSSOP24]
U204  LM1117  [SOT223]
U205  74LVC8T245  [TSSOP24]
U206  NC7WZ16  [SC70]
U207  74LVC8T245  [TSSOP24]
U208  TFDU4101  [TDFU4101]

### Blocks framed on the sheet
low-noise analog power supply: C209-C212 L202 U204

### Ports
BIAS (out, see 7), DISP1_DAT[0..23] (in, see 1), DISP1_HSYNC (in, see 1), DISP1_OE_ACD (in, see 1), DISP1_SCLK (in, see 1), DISP1_VSYNC (in, see 1), FCLK (out, see 7), GPIO2 (in, see 1), GPIO3 (in, see 1), GPIO11 (in, see 1), IR_RXD (out, see 2, 9), IR_TXD (in, see 9), LCLK (out, see 7), LDD[0..23] (out, see 7), PCLK (out, see 7), PLED (in, see 9), PSAVE (out, see 7), PWM (in, see 1), TSMX (see 3), TSMY (see 3), TSPX (see 3), TSPY (see 3), VGA_BLUE (out, see 7), VGA_GREEN (out, see 7), VGA_HSYNC (out, see 7), VGA_RED (out, see 7), VGA_VSYNC (out, see 7)

### Nets
3V3: R200.1 TP200.1
5V: C211.2 C212.2 C215.2 H200.33 H200.34 R201.1 R208.1 R209.1 R210.1 R214.1 U204.3(VIN) U206.5(VCC)
GND: C200.1 C206.1 C207.1 C208.1 C209.1 C210.1 C211.1 C212.1 C213.1 C214.1 C215.1 C216.1 C217.1 C218.1 C219.1 C220.1 C221.1 C222.2 C224.1 C225.1 C226.1 H200.1 H200.5 H200.12 H200.19 H200.26 H200.35 H200.36 L203.1 R212.2 T200.2(S) T201.2(S) T202.2(S) U200.11(GND) U200.12(GND) U200.13(GND) U200.22(~{OE}) U201.12(~{SYNC}) U202.2(GND) U203.11(GND) U203.12(GND) U203.13(GND) U203.22(~{OE}) U204.1(GND) U205.11(GND) U205.12(GND) U205.13(GND) U205.22(~{OE}) U206.2(GND) U207.11(GND) U207.12(GND) U207.13(GND) U207.22(~{OE}) U208.5(SD) U208.8(GND)
VGND: C203.1 C204.1 C205.1 C223.2 L203.2 R202.1 R203.1 R204.1 R205.1 U201.1(GND) U201.2(GND) U201.14(GND) U201.15(GND) U201.25(GND) U201.26(GND) U201.27(~{IOB}) U201.31(~{IOG}) U201.33(~{IOR}) U201.39(GND) U201.40(GND)
VIO: C208.2 C214.2 C219.2 C221.2 U200.1(VCCA) U200.2(DIR) U203.1(VCCA) U203.2(DIR) U205.1(VCCA) U205.2(DIR) U207.1(VCCA) U207.2(DIR)
VLCD: C200.2 C207.2 C213.2 C218.2 C220.2 C223.1 H200.28 L200.2 L206.1 U200.23(VCCB) U200.24(VCCB) U203.23(VCCB) U203.24(VCCB) U205.23(VCCB) U205.24(VCCB) U207.23(VCCB) U207.24(VCCB)
VSB: C226.2 R211.1 R213.2 R215.1 T203.1(G)
VVGA: C201.2 C202.2 C203.2 C204.2 C205.2 L200.1 L202.1 U201.13(VAA) U201.29(VAA) U201.30(VAA)
BIAS: H200.27 RN206.5 U201.11(~{BLANK}) ; port BIAS
DISP1_DAT0: U200.3(A1)
DISP1_DAT1: U200.4(A2)
DISP1_DAT2: U200.5(A3)
DISP1_DAT3: U200.6(A4)
DISP1_DAT4: U200.7(A5)
DISP1_DAT5: U200.8(A6)
DISP1_DAT6: U200.9(A7)
DISP1_DAT7: U200.10(A8)
DISP1_DAT8: U203.3(A1)
DISP1_DAT9: U203.4(A2)
DISP1_DAT10: U203.5(A3)
DISP1_DAT11: U203.6(A4)
DISP1_DAT12: U203.7(A5)
DISP1_DAT13: U203.8(A6)
DISP1_DAT14: U203.9(A7)
DISP1_DAT15: U203.10(A8)
DISP1_DAT16: U205.3(A1)
DISP1_DAT17: U205.4(A2)
DISP1_DAT18: U205.5(A3)
DISP1_DAT19: U205.6(A4)
DISP1_DAT20: U205.7(A5)
DISP1_DAT21: U205.8(A6)
DISP1_DAT22: U205.9(A7)
DISP1_DAT23: U205.10(A8)
DISP1_HSYNC: U207.4(A2) ; port DISP1_HSYNC
DISP1_OE_ACD: U207.6(A4) ; port DISP1_OE_ACD
DISP1_SCLK: U207.5(A3) ; port DISP1_SCLK
DISP1_VSYNC: U207.3(A1) ; port DISP1_VSYNC
FCLK: H200.4 RN206.8 U206.3(A2) ; port FCLK
GPIO2: U207.8(A6) ; port GPIO2
GPIO3: U207.9(A7) ; port GPIO3
GPIO11: U207.10(A8) ; port GPIO11
IR_RXD: R211.2 T203.2(S) U208.4(RXD) ; port IR_RXD
IR_TXD: U208.3(TXD) ; port IR_TXD
LCLK: H200.3 RN206.7 U206.1(A1) ; port LCLK
LDD0: RN200.8 U201.16(B0)
LDD1: RN200.7 U201.17(B1)
LDD2: H200.20 RN200.6 U201.18(B2)
LDD3: H200.21 RN200.5 U201.19(B3)
LDD4: H200.22 RN201.8 U201.20(B4)
LDD5: H200.23 RN201.7 U201.21(B5)
LDD6: H200.24 RN201.6 U201.22(B6)
LDD7: H200.25 RN201.5 U201.23(B7)
LDD8: RN202.8 U201.3(G0)
LDD9: RN202.7 U201.4(G1)
LDD10: H200.13 RN202.6 U201.5(G2)
LDD11: H200.14 RN202.5 U201.6(G3)
LDD12: H200.15 RN203.8 U201.7(G4)
LDD13: H200.16 RN203.7 U201.8(G5)
LDD14: H200.17 RN203.6 U201.9(G6)
LDD15: H200.18 RN203.5 U201.10(G7)
LDD16: RN204.8 U201.41(R0)
LDD17: RN204.7 U201.42(R1)
LDD18: H200.6 RN204.6 U201.43(R2)
LDD19: H200.7 RN204.5 U201.44(R3)
LDD20: H200.8 RN205.8 U201.45(R4)
LDD21: H200.9 RN205.7 U201.46(R5)
LDD22: H200.10 RN205.6 U201.47(R6)
LDD23: H200.11 RN205.5 U201.48(R7)
LGPIO0: H200.31 RN207.7 T200.1(G)
LGPIO1: H200.30 RN207.6 T201.1(G)
LPWM: H200.32 RN207.8
P11: C222.1 L206.2 R200.2 TP201.1
PCLK: H200.2 RN206.6 U201.24(CLOCK) ; port PCLK
PLED: R212.1 T202.1(G) ; port PLED
PSAVE: H200.29 RN207.5 U201.38(~{PSAVE}) ; port PSAVE
PWM: U207.7(A5) ; port PWM
TSMX: H200.37 ; port TSMX
TSMY: H200.38 ; port TSMY
TSPX: H200.39 ; port TSPX
TSPY: H200.40 ; port TSPY
VGA_BLUE: R205.2 U201.28(IOB) ; port VGA_BLUE
VGA_GREEN: R204.2 U201.32(IOG) ; port VGA_GREEN
VGA_HSYNC: C216.2 L204.2 ; port VGA_HSYNC
VGA_RED: R203.2 U201.34(IOR) ; port VGA_RED
VGA_VSYNC: C217.2 L205.2 ; port VGA_VSYNC
NetC201_1: C201.1 U201.36(VREF)
NetC202_1: C202.1 U201.35(COMP)
NetC206_2: C206.2 C224.2 R214.2 U202.3(VCC)
NetC209_2: C209.2 C210.2 L202.2 U204.2(VOUT)
NetC225_2: C225.2 R215.2 U208.6(VCC1)
NetL204_1: L204.1 R206.1
NetL205_1: L205.1 R207.1
NetLH200_1: LH200.1 T202.3(D)
NetLH200_2: LH200.2 R208.2
NetLH200_3: LH200.3 T201.3(D)
NetLH200_4: LH200.4 R209.2
NetLH200_5: LH200.5 T200.3(D)
NetLH200_6: LH200.6 R210.2
NetR201_2: R201.2 T203.3(D) U202.1(OUT)
NetR202_2: R202.2 U201.37(RSET)
NetR206_2: R206.2 U206.6(Y1)
NetR207_2: R207.2 U206.4(Y2)
NetR213_1: R213.1 U208.1(VCC2)
NetRN200_1: RN200.1 U200.21(B1)
NetRN200_2: RN200.2 U200.20(B2)
NetRN200_3: RN200.3 U200.19(B3)
NetRN200_4: RN200.4 U200.18(B4)
NetRN201_1: RN201.1 U200.17(B5)
NetRN201_2: RN201.2 U200.16(B6)
NetRN201_3: RN201.3 U200.15(B7)
NetRN201_4: RN201.4 U200.14(B8)
NetRN202_1: RN202.1 U203.21(B1)
NetRN202_2: RN202.2 U203.20(B2)
NetRN202_3: RN202.3 U203.19(B3)
NetRN202_4: RN202.4 U203.18(B4)
NetRN203_1: RN203.1 U203.17(B5)
NetRN203_2: RN203.2 U203.16(B6)
NetRN203_3: RN203.3 U203.15(B7)
NetRN203_4: RN203.4 U203.14(B8)
NetRN204_1: RN204.1 U205.21(B1)
NetRN204_2: RN204.2 U205.20(B2)
NetRN204_3: RN204.3 U205.19(B3)
NetRN204_4: RN204.4 U205.18(B4)
NetRN205_1: RN205.1 U205.17(B5)
NetRN205_2: RN205.2 U205.16(B6)
NetRN205_3: RN205.3 U205.15(B7)
NetRN205_4: RN205.4 U205.14(B8)
NetRN206_1: RN206.1 U207.21(B1)
NetRN206_2: RN206.2 U207.20(B2)
NetRN206_3: RN206.3 U207.19(B3)
NetRN206_4: RN206.4 U207.18(B4)
NetRN207_1: RN207.1 U207.17(B5)
NetRN207_2: RN207.2 U207.16(B6)
NetRN207_3: RN207.3 U207.15(B7)
NetRN207_4: RN207.4 U207.14(B8)

Not connected (* = marked no-connect by the designer): U208 2(IREDC)* 7(NC)*

### Buses and harness runs
bus DISP1_DAT[0..23] = port DISP1_DAT[0..23]
bus LDD[0..23] = port LDD[0..23]

### Notes on the sheet
- 1 [mA] = 10 * U [mV]
- Designed By
- Checked By
- Company:
- Size:
- A3
- Address:
- Sheet:
- /
- (in symbol LEDH3) GREEN; YELLOW; RED

### Library data of the parts
C200-C221 C224-C226 = C
C222 C223 = C+
L200 L202-L206 = FBEAD
R200-R215 = R
RN200-RN207 = RN4
TP200 TP201 = TESTPOINT: as TP100 on sheet [03] - DIMM CON; Component class: TP; Producer: n/a; Assembly type: no component
U201 = ADV7125
U202 = SFH5110

## Sheet [05] - AUDIO.SchDoc
size A3; CompanyName: FPT-FTI copporation; Address1: FPT Building Duy Tan; Address2: Floor 4,; DocumentNumber: 5; SheetNumber: 5; SheetTotal: 13; NameAuthor: Angle Vu
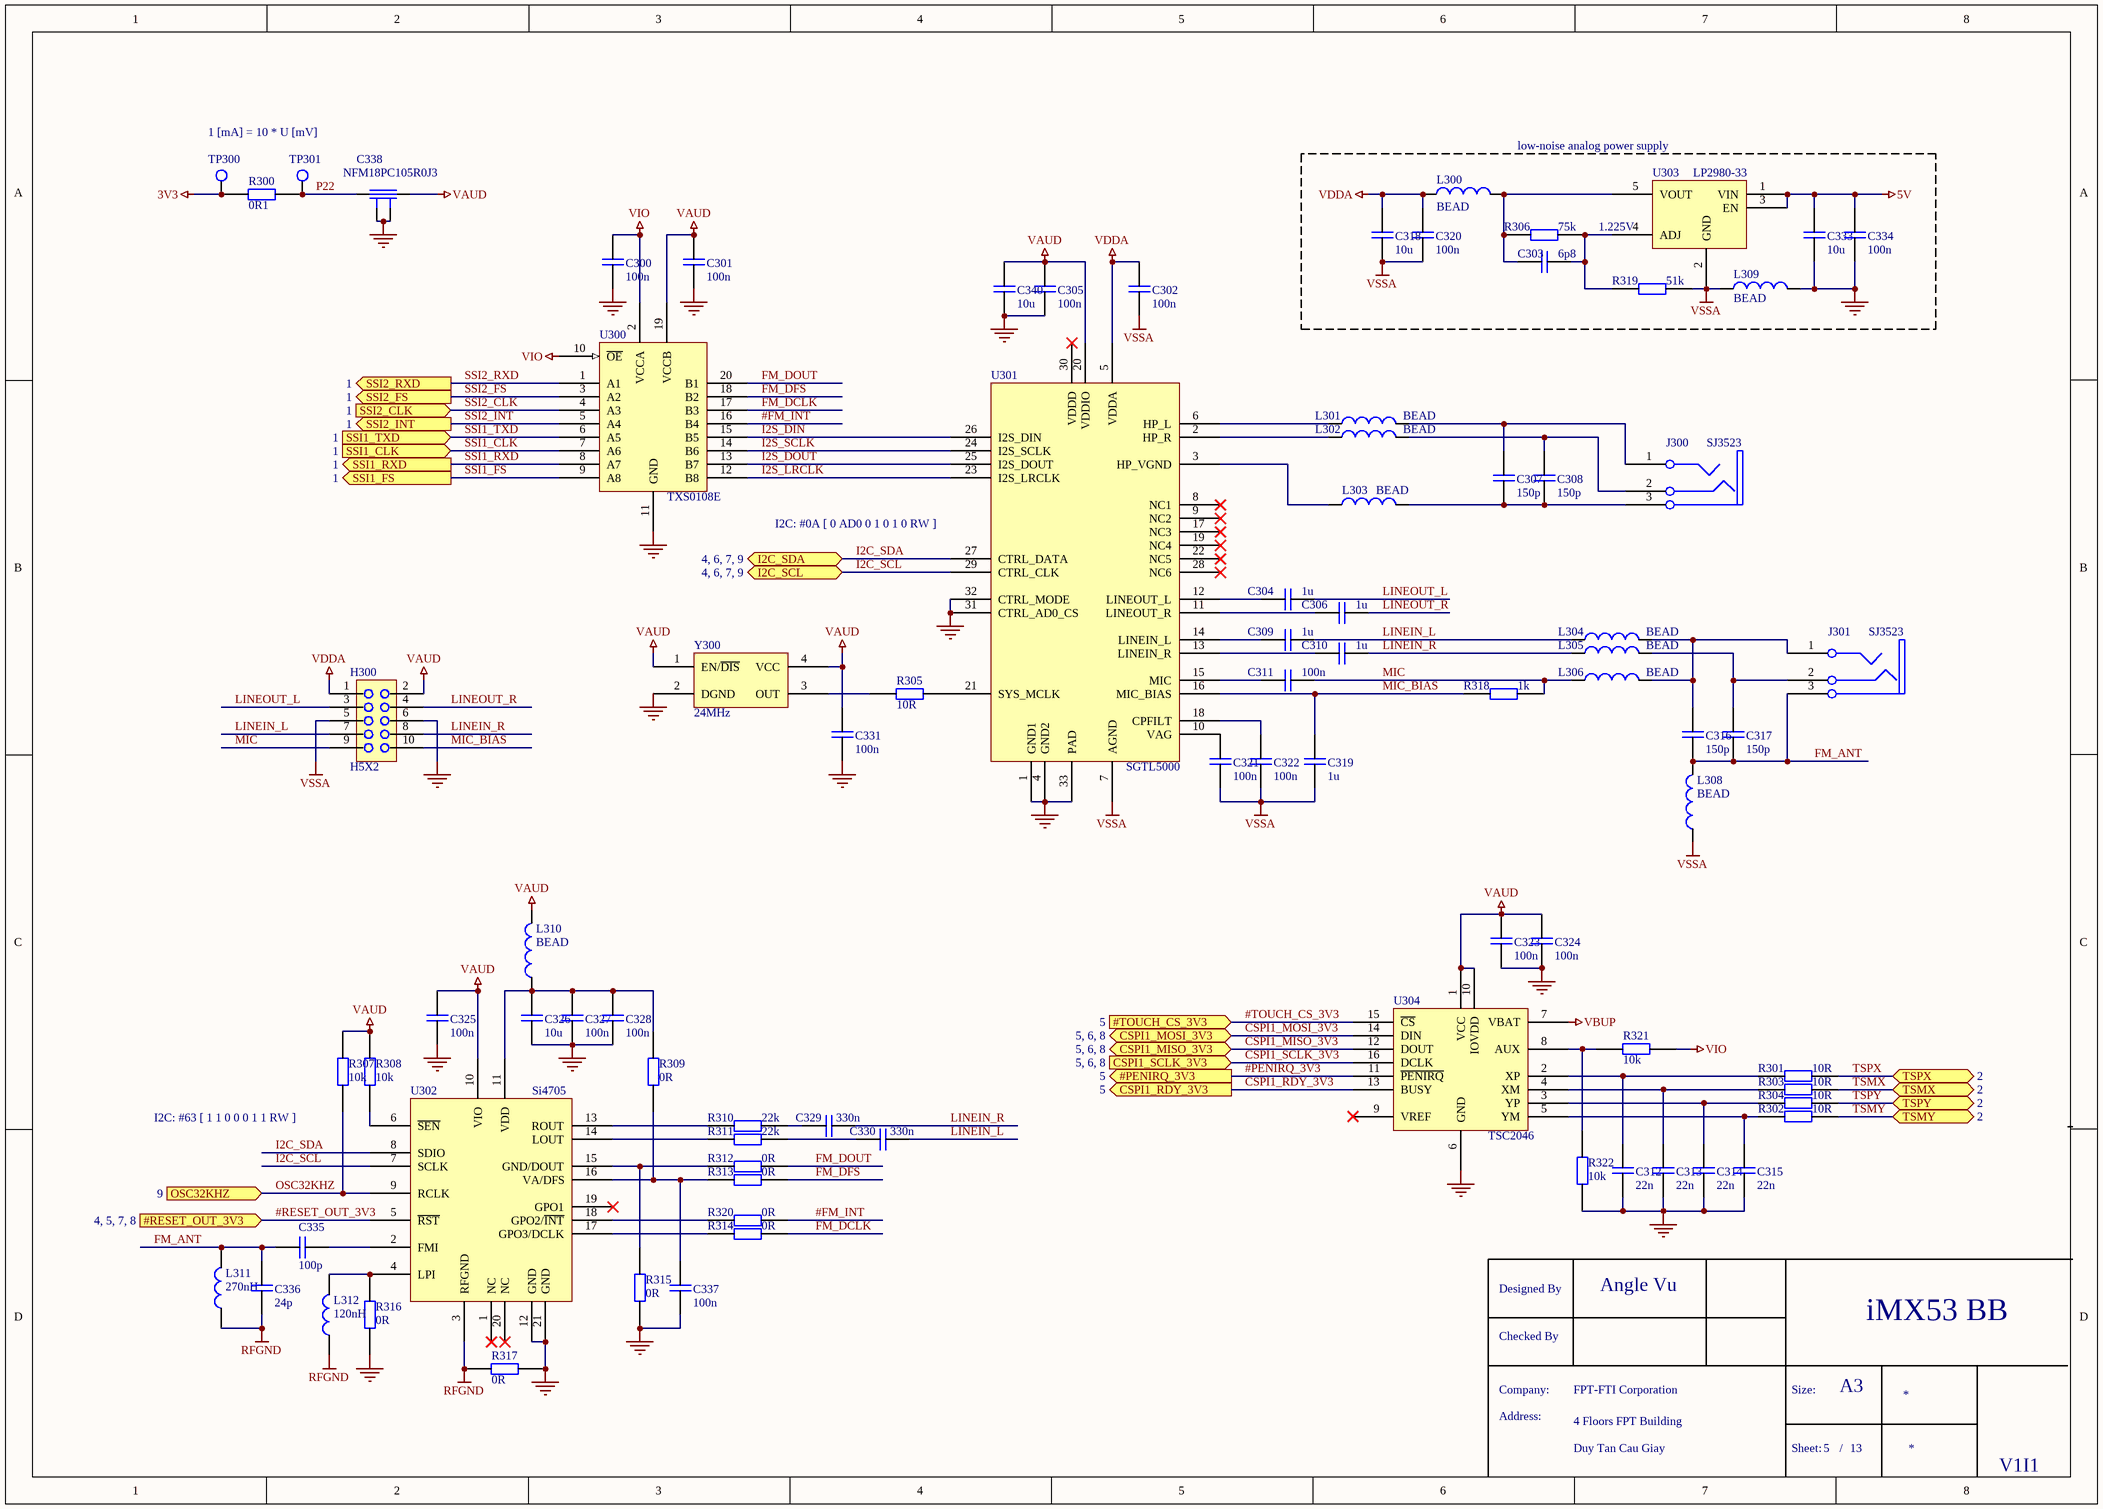
[diagram p5: [05] - AUDIO.SchDoc]

### Parts
C300  100n  [0603]
C301  100n  [0603]
C302  100n  [0603]
C303  6p8  [0603]
C304  1u  [0603]
C305  100n  [0603]
C306  1u  [0603]
C307  150p  [0603]
C308  150p  [0603]
C309  1u  [0603]
C310  1u  [0603]
C311  100n  [0603]
C312  22n  [0603]
C313  22n  [0603]
C314  22n  [0603]
C315  22n  [0603]
C316  150p  [0603]
C317  150p  [0603]
C318  10u  [0805]
C319  1u  [0603]
C320  100n  [0603]
C321  100n  [0603]
C322  100n  [0603]
C323  100n  [0603]
C324  100n  [0603]
C325  100n  [0603]
C326  10u  [0805]
C327  100n  [0603]
C328  100n  [0603]
C329  330n  [0603]
C330  330n  [0603]
C331  100n  [0603]
C333  10u  [0805]
C334  100n  [0603]
C335  100p  [0603]
C336  24p  [0603]
C337  100n  [0603]
C338  NFM18PC105R0J3  [NFM18P]
C340  10u  [0805]
H300  H5X2  [H2x5]
J300  SJ3523  [SJ35_NS]
J301  SJ3523  [SJ35_NS]
L300  BEAD  [0603]
L301  BEAD  [0603]
L302  BEAD  [0603]
L303  BEAD  [0603]
L304  BEAD  [0603]
L305  BEAD  [0603]
L306  BEAD  [0603]
L308  BEAD  [0603]
L309  BEAD  [0603]
L310  BEAD  [0603]
L311  270nH  [0603]
L312  120nH  [0603]
R300  0R1  [0603]
R301  10R  [0603]
R302  10R  [0603]
R303  10R  [0603]
R304  10R  [0603]
R305  10R  [0603]
R306  75k  [0603]
R307  10k  [0603]
R308  10k  [0603]
R309  0R  [0603]
R310  22k  [0603]
R311  22k  [0603]
R312  0R  [0603]
R313  0R  [0603]
R314  0R  [0603]
R315  0R  [0603]
R316  0R  [0603]
R317  0R  [0603]
R318  1k  [0603]
R319  51k  [0603]
R320  0R  [0603]
R321  10k  [0603]
R322  10k  [0603]
TP300  TESTPOINT  [TESTPOINT_2mm]  (value not drawn)
TP301  TESTPOINT  [TESTPOINT_2mm]  (value not drawn)
U300  TXS0108E  [TSSOP20]
U301  SGTL5000  [QFN32]
U302  Si4705  [QFN20]
U303  LP2980-33  [SOT23-5]
U304  TSC2046  [TSSOP16]
Y300  24MHz  [JO75]

### Ports
#PENIRQ_3V3 (out, see 5), #RESET_OUT_3V3 (in, see 4, 5, 7, 8), #TOUCH_CS_3V3 (in, see 5), CSPI1_MISO_3V3 (bidir, see 5, 6, 8), CSPI1_MOSI_3V3 (bidir, see 5, 6, 8), CSPI1_RDY_3V3 (out, see 5), CSPI1_SCLK_3V3 (in, see 5, 6, 8), I2C_SCL (bidir, see 4, 6, 7, 9), I2C_SDA (bidir, see 4, 6, 7, 9), OSC32KHZ (in, see 9), SSI1_CLK (in, see 1), SSI1_FS (out, see 1), SSI1_RXD (out, see 1), SSI1_TXD (in, see 1), SSI2_CLK (in, see 1), SSI2_FS (out, see 1), SSI2_INT (out, see 1), SSI2_RXD (out, see 1), TSMX (see 2), TSMY (see 2), TSPX (see 2), TSPY (see 2)

### Nets
3V3: R300.1 TP300.1
5V: C333.2 C334.2 U303.1(VIN) U303.3(EN)
GND: C300.1 C301.1 C305.1 C312.1 C313.1 C314.1 C315.1 C323.1 C324.1 C325.1 C326.1 C327.1 C328.1 C331.1 C333.1 C334.1 C337.1 C338.2 C338.4 C340.1 H300.6 L309.1 R315.1 R316.1 R317.1 R322.1 U300.11(GND) U301.1(GND1) U301.4(GND2) U301.31(CTRL_AD0_CS) U301.32(CTRL_MODE) U301.33(PAD) U302.12(GND) U302.21(GND) U304.6(GND) Y300.2(DGND)
RFGND: C336.2 L311.1 L312.1 R317.2 U302.3(RFGND)
VAUD: C301.2 C305.2 C323.2 C324.2 C325.2 C331.2 C338.3 C340.2 H300.2 L310.2 R307.2 R308.2 U300.19(VCCB) U301.20(VDDIO) U302.10(VIO) U304.1(VCC) U304.10(IOVDD) Y300.1(EN/~{DIS}) Y300.4(VCC)
VBUP: U304.7(VBAT)
VDDA: C302.2 C318.2 C320.2 H300.1 L300.1 U301.5(VDDA)
VIO: C300.2 R321.1 U300.2(VCCA) U300.10(~{OE})
VSSA: C302.1 C318.1 C319.2 C320.1 C321.1 C322.1 H300.5 L308.1 L309.2 R319.1 U301.7(AGND) U303.2(GND)
#FM_INT: R320.1 U300.16(B4)
#PENIRQ_3V3: U304.11(~{PENIRQ}) ; port #PENIRQ_3V3
#RESET_OUT_3V3: U302.5(~{RST}) ; port #RESET_OUT_3V3
#TOUCH_CS_3V3: U304.15(~{CS}) ; port #TOUCH_CS_3V3
CSPI1_MISO_3V3: U304.12(DOUT) ; port CSPI1_MISO_3V3
CSPI1_MOSI_3V3: U304.14(DIN) ; port CSPI1_MOSI_3V3
CSPI1_RDY_3V3: U304.13(BUSY) ; port CSPI1_RDY_3V3
CSPI1_SCLK_3V3: U304.16(DCLK) ; port CSPI1_SCLK_3V3
FM_ANT: C316.1 C317.1 C335.2 C336.1 J301.3 L308.2 L311.2
FM_DCLK: R314.1 U300.17(B3)
FM_DFS: R313.1 U300.18(B2)
FM_DOUT: R312.1 U300.20(B1)
I2C_SCL: U301.29(CTRL_CLK) U302.7(SCLK) ; port I2C_SCL
I2C_SDA: U301.27(CTRL_DATA) U302.8(SDIO) ; port I2C_SDA
I2S_DIN: U300.15(B5) U301.26(I2S_DIN)
I2S_DOUT: U300.13(B7) U301.25(I2S_DOUT)
I2S_LRCLK: U300.12(B8) U301.23(I2S_LRCLK)
I2S_SCLK: U300.14(B6) U301.24(I2S_SCLK)
LINEIN_L: C309.1 C330.1 H300.7 L304.1
LINEIN_R: C310.1 C329.1 H300.8 L305.1
LINEOUT_L: C304.1 H300.3
LINEOUT_R: C306.1 H300.4
MIC: C311.1 H300.9 L306.1 R318.1
MIC_BIAS: C319.1 H300.10 R318.2 U301.16(MIC_BIAS)
OSC32KHZ: R307.1 U302.9(RCLK) ; port OSC32KHZ
P22: C338.1 R300.2 TP301.1
SSI1_CLK: U300.7(A6) ; port SSI1_CLK
SSI1_FS: U300.9(A8) ; port SSI1_FS
SSI1_RXD: U300.8(A7) ; port SSI1_RXD
SSI1_TXD: U300.6(A5) ; port SSI1_TXD
SSI2_CLK: U300.4(A3) ; port SSI2_CLK
SSI2_FS: U300.3(A2) ; port SSI2_FS
SSI2_INT: U300.5(A4) ; port SSI2_INT
SSI2_RXD: U300.1(A1) ; port SSI2_RXD
TSMX: R303.2 ; port TSMX
TSMY: R302.2 ; port TSMY
TSPX: R301.2 ; port TSPX
TSPY: R304.2 ; port TSPY
NetC303_1: C303.1 R306.1 R319.2 U303.4(ADJ)
NetC303_2: C303.2 L300.2 R306.2 U303.5(VOUT)
NetC304_2: C304.2 U301.12(LINEOUT_L)
NetC306_2: C306.2 U301.11(LINEOUT_R)
NetC307_1: C307.1 C308.1 J300.3 L303.2
NetC307_2: C307.2 J300.1 L301.2
NetC308_2: C308.2 J300.2 L302.2
NetC309_2: C309.2 U301.14(LINEIN_L)
NetC310_2: C310.2 U301.13(LINEIN_R)
NetC311_2: C311.2 U301.15(MIC)
NetC312_2: C312.2 R301.1 U304.2(XP)
NetC313_2: C313.2 R303.1 U304.4(XM)
NetC314_2: C314.2 R304.1 U304.3(YP)
NetC315_2: C315.2 R302.1 U304.5(YM)
NetC316_2: C316.2 J301.1 L304.2 L306.2
NetC317_2: C317.2 J301.2 L305.2
NetC321_2: C321.2 U301.10(VAG)
NetC322_2: C322.2 U301.18(CPFILT)
NetC326_2: C326.2 C327.2 C328.2 L310.1 R309.2 U302.11(VDD)
NetC329_2: C329.2 R310.1
NetC330_2: C330.2 R311.1
NetC335_1: C335.1 U302.2(FMI)
NetC337_2: C337.2 R309.1 R313.2 U302.16(VA/DFS)
NetL301_1: L301.1 U301.6(HP_L)
NetL302_1: L302.1 U301.2(HP_R)
NetL303_1: L303.1 U301.3(HP_VGND)
NetL312_2: L312.2 R316.2 U302.4(LPI)
NetR305_1: R305.1 Y300.3(OUT)
NetR305_2: R305.2 U301.21(SYS_MCLK)
NetR308_1: R308.1 U302.6(~{SEN})
NetR310_2: R310.2 U302.13(ROUT)
NetR311_2: R311.2 U302.14(LOUT)
NetR312_2: R312.2 R315.2 U302.15(GND/DOUT)
NetR314_2: R314.2 U302.17(GPO3/DCLK)
NetR320_2: R320.2 U302.18(GPO2/~{INT})
NetR321_2: R321.2 R322.2 U304.8(AUX)

Not connected (* = marked no-connect by the designer): U301 8(NC1)* 9(NC2)* 17(NC3)* 19(NC4)* 22(NC5)* 28(NC6)* 30(VDDD)*; U302 1(NC)* 19(GPO1)* 20(NC)*; U304 9(VREF)*

### Notes on the sheet
- 1 [mA] = 10 * U [mV]
- low-noise analog power supply
- (near U303) 1.225V
- (near U301) I2C: #0A [ 0 AD0 0 1 0 1 0 RW ]
- I2C: #63 [ 1 1 0 0 0 1 1 RW ]
- Designed By
- Checked By
- Company:
- Size:
- A3
- Address:
- Sheet:
- /

### Library data of the parts
C300-C331 C333-C337 C340 = C
C338 = NFL21S: Chip EMIFIL; Producer: Murata; Order number: NFM18PC105R0J3; Component class: C; Assembly type: SMT
L300-L306 L308-L310 = FBEAD
L311 L312 = L
R300-R322 = R
TP300 TP301 = TESTPOINT: as TP100 on sheet [03] - DIMM CON; Component class: TP; Producer: n/a; Assembly type: no component
U302 = Si470x
U303 = LP2980
Y300 = OSC

## Sheet [06] - USB.SchDoc
size A3; CompanyName: FPT-FTI copporation; Address1: FPT Building Duy Tan; Address2: Floor 4,; DocumentNumber: 6; SheetNumber: 6; SheetTotal: 13; NameAuthor: Angle Vu
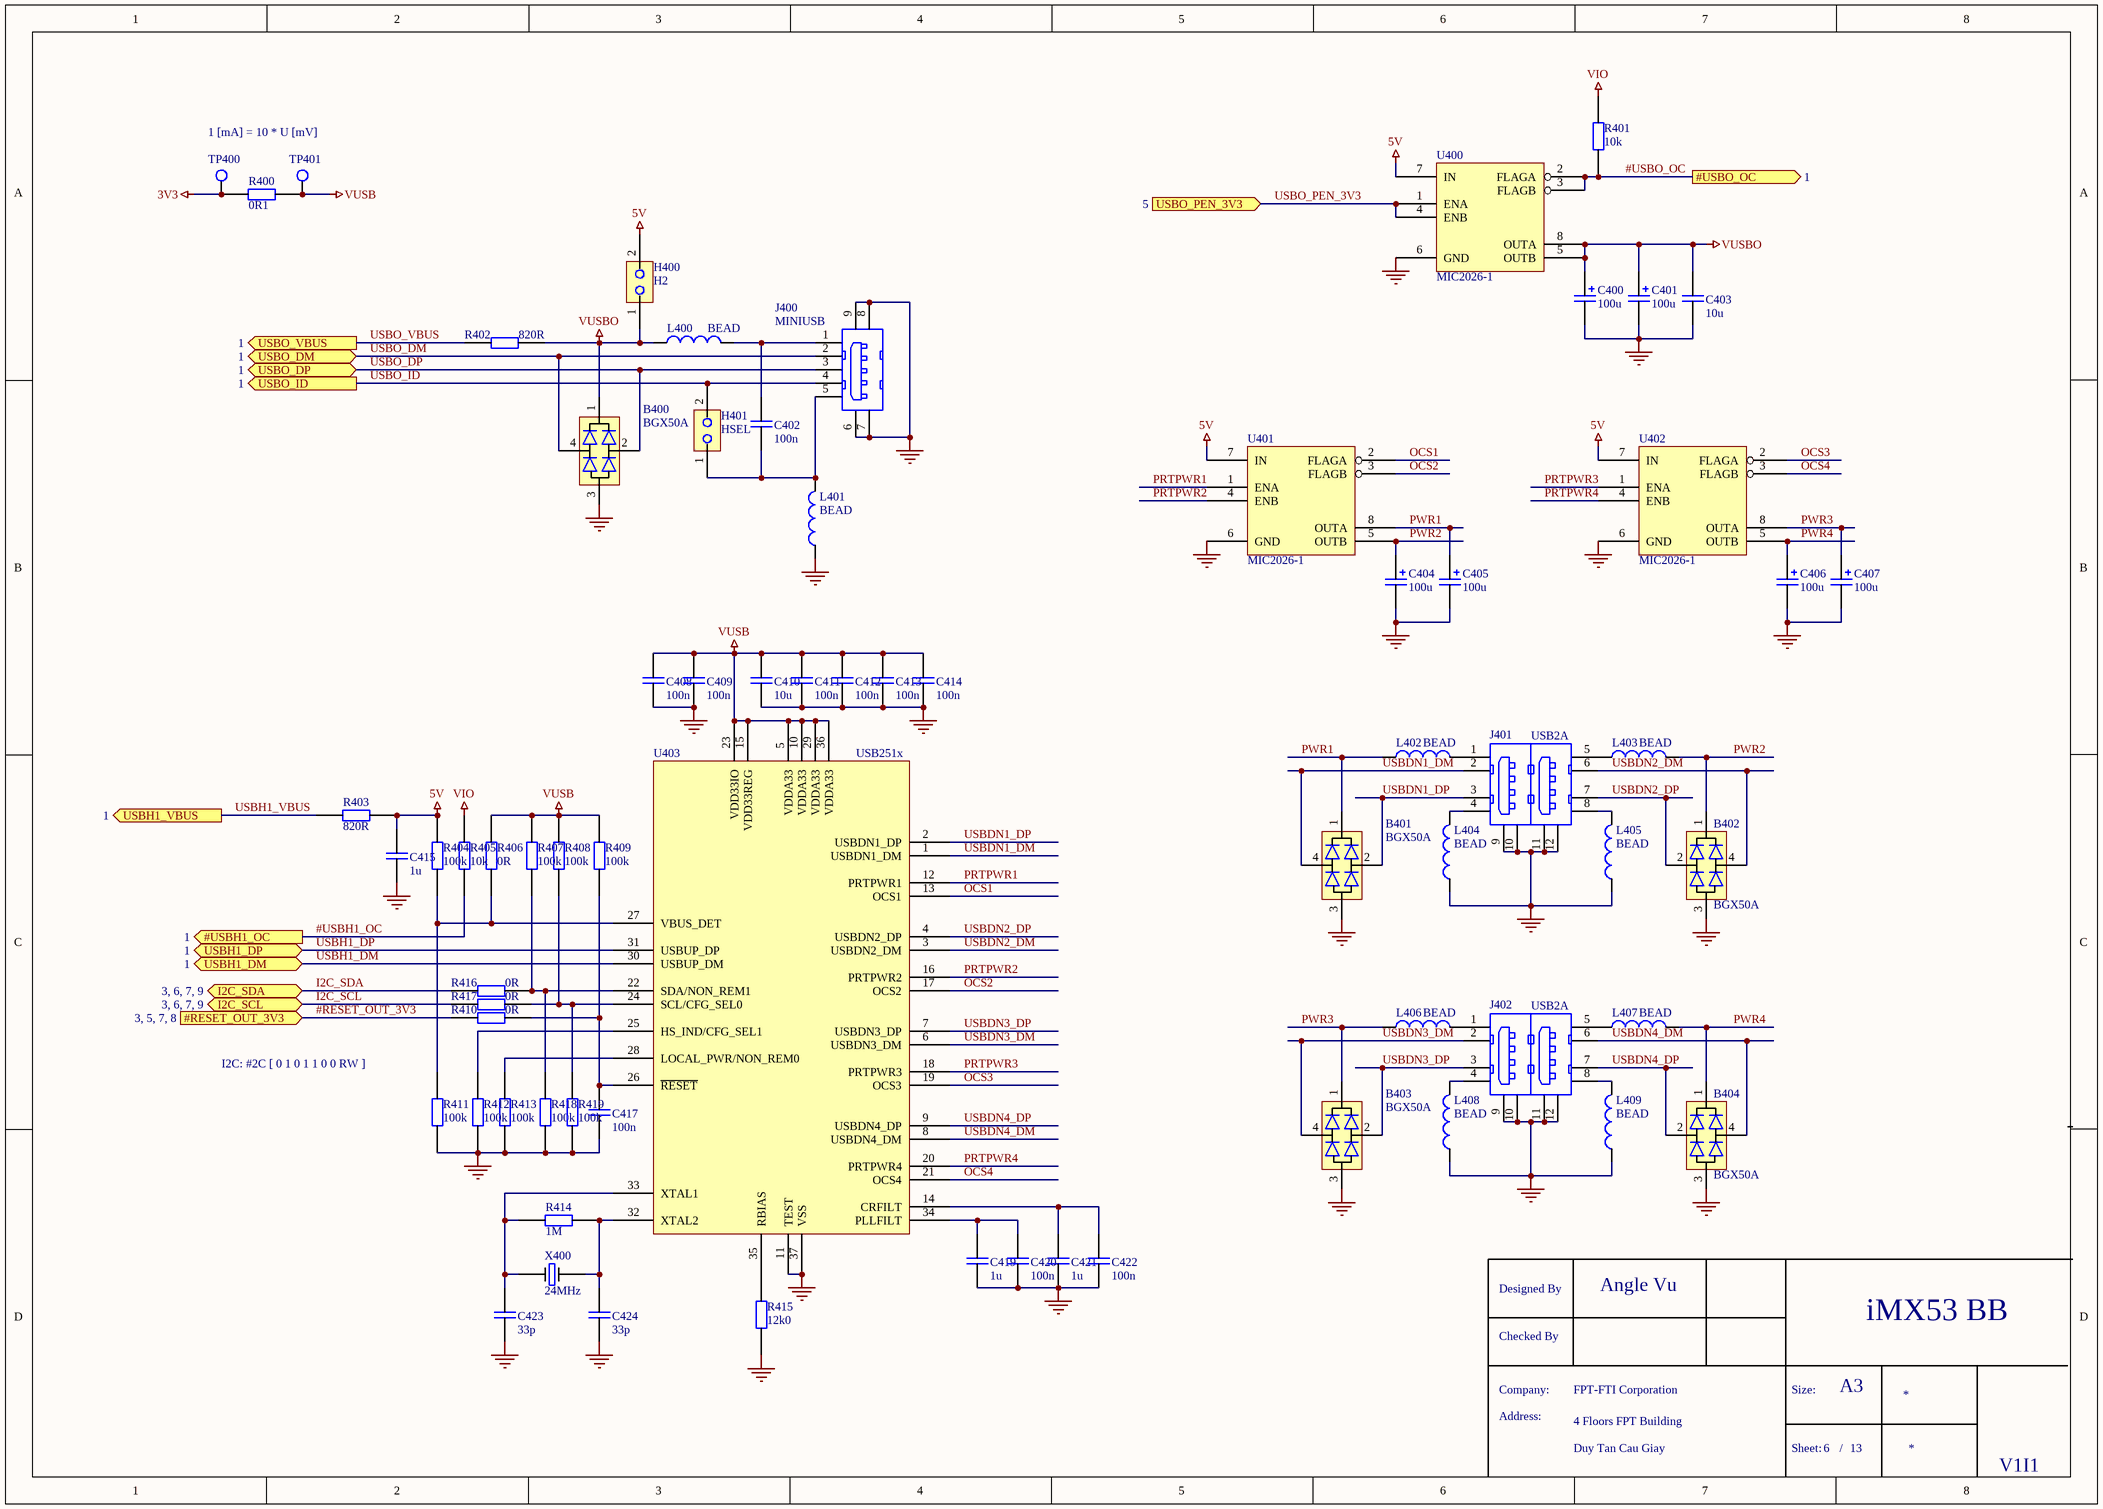
[diagram p6: [06] - USB.SchDoc]

### Parts
B400  BGX50A  [SOT143]
B401  BGX50A  [SOT143]
B402  BGX50A  [SOT143]
B403  BGX50A  [SOT143]
B404  BGX50A  [SOT143]
C400  100u  [CTANTALD]
C401  100u  [CTANTALD]
C402  100n  [0603]
C403  10u  [0805]
C404  100u  [CTANTALD]
C405  100u  [CTANTALD]
C406  100u  [CTANTALD]
C407  100u  [CTANTALD]
C408  100n  [0603]
C409  100n  [0603]
C410  10u  [0805]
C411  100n  [0603]
C412  100n  [0603]
C413  100n  [0603]
C414  100n  [0603]
C415  1u  [0603]
C417  100n  [0603]
C419  1u  [0603]
C420  100n  [0603]
C421  1u  [0603]
C422  100n  [0603]
C423  33p  [0603]
C424  33p  [0603]
H400  H2  [H1x2]
H401  HSEL  [H1x2]
J400  MINIUSB  [MINI_USB_AB]
J401  USB2A  [USB-2A]
J402  USB2A  [USB-2A]
L400  BEAD  [0603]
L401  BEAD  [0603]
L402  BEAD  [0603]
L403  BEAD  [0603]
L404  BEAD  [0603]
L405  BEAD  [0603]
L406  BEAD  [0603]
L407  BEAD  [0603]
L408  BEAD  [0603]
L409  BEAD  [0603]
R400  0R1  [0603]
R401  10k  [0603]
R402  820R  [0603]
R403  820R  [0603]
R404  100k  [0603]
R405  10k  [0603]
R406  0R  [0603]
R407  100k  [0603]
R408  100k  [0603]
R409  100k  [0603]
R410  0R  [0603]
R411  100k  [0603]
R412  100k  [0603]
R413  100k  [0603]
R414  1M  [0603]
R415  12k0  [0603]
R416  0R  [0603]
R417  0R  [0603]
R418  100k  [0603]
R419  100k  [0603]
TP400  TESTPOINT  [TESTPOINT_2mm]  (value not drawn)
TP401  TESTPOINT  [TESTPOINT_2mm]  (value not drawn)
U400  MIC2026-1  [SOIC8N]
U401  MIC2026-1  [SOIC8N]
U402  MIC2026-1  [SOIC8N]
U403  USB251x  [QFN36]
X400  24MHz  [HC494H]

### Ports
#RESET_OUT_3V3 (in, see 3, 5, 7, 8), #USBH1_OC (out, see 1), #USBO_OC (out, see 1), I2C_SCL (bidir, see 3, 6, 7, 9), I2C_SDA (bidir, see 3, 6, 7, 9), USBH1_DM (bidir, see 1), USBH1_DP (bidir, see 1), USBH1_VBUS (out, see 1), USBO_DM (bidir, see 1), USBO_DP (bidir, see 1), USBO_ID (out, see 1), USBO_PEN_3V3 (in, see 5), USBO_VBUS (out, see 1)

### Nets
3V3: R400.1 TP400.1
5V: C415.2 H400.2 R403.1 R404.2 U400.7(IN) U401.7(IN) U402.7(IN)
GND: B400.3 B401.3 B402.3 B403.3 B404.3 C400.2 C401.2 C403.1 C404.2 C405.2 C406.2 C407.2 C408.1 C409.1 C410.1 C411.1 C412.1 C413.1 C414.1 C415.1 C417.1 C419.1 C420.1 C421.1 C422.1 C423.1 C424.1 J400.6(SHIELD) J400.7(SHIELD) J400.8(SHIELD) J400.9(SHIELD) J401.9(SHIELD) J401.10(SHIELD) J401.11(SHIELD) J401.12(SHIELD) J402.9(SHIELD) J402.10(SHIELD) J402.11(SHIELD) J402.12(SHIELD) L401.1 L404.1 L405.1 L408.1 L409.1 R411.2 R412.2 R413.2 R415.1 R418.2 R419.2 U400.6(GND) U401.6(GND) U402.6(GND) U403.11(TEST) U403.37(VSS)
VIO: R401.1 R405.1
VUSB: C408.2 C409.2 C410.2 C411.2 C412.2 C413.2 C414.2 R400.2 R406.2 R407.1 R408.1 R409.1 TP401.1 U403.5(VDDA33) U403.10(VDDA33) U403.15(VDD33REG) U403.23(VDD33IO) U403.29(VDDA33) U403.36(VDDA33)
VUSBO: B400.1 C400.1 C401.1 C403.2 H400.1 L400.1 R402.1 U400.5(OUTB) U400.8(OUTA)
#RESET_OUT_3V3: R410.2 ; port #RESET_OUT_3V3
#USBH1_OC: R405.2 ; port #USBH1_OC
#USBO_OC: R401.2 U400.2(FLAGA) U400.3(FLAGB) ; port #USBO_OC
I2C_SCL: R417.2 ; port I2C_SCL
I2C_SDA: R416.2 ; port I2C_SDA
OCS1: U401.2(FLAGA) U403.13(OCS1)
OCS2: U401.3(FLAGB) U403.17(OCS2)
OCS3: U402.2(FLAGA) U403.19(OCS3)
OCS4: U402.3(FLAGB) U403.21(OCS4)
PRTPWR1: U401.1(ENA) U403.12(PRTPWR1)
PRTPWR2: U401.4(ENB) U403.16(PRTPWR2)
PRTPWR3: U402.1(ENA) U403.18(PRTPWR3)
PRTPWR4: U402.4(ENB) U403.20(PRTPWR4)
PWR1: B401.1 C405.1 L402.1 U401.8(OUTA)
PWR2: B402.1 C404.1 L403.2 U401.5(OUTB)
PWR3: B403.1 C407.1 L406.1 U402.8(OUTA)
PWR4: B404.1 C406.1 L407.2 U402.5(OUTB)
USBDN1_DM: B401.4 J401.2(D-) U403.1(USBDN1_DM)
USBDN1_DP: B401.2 J401.3(D+) U403.2(USBDN1_DP)
USBDN2_DM: B402.4 J401.6(D2-) U403.3(USBDN2_DM)
USBDN2_DP: B402.2 J401.7(D2+) U403.4(USBDN2_DP)
USBDN3_DM: B403.4 J402.2(D-) U403.6(USBDN3_DM)
USBDN3_DP: B403.2 J402.3(D+) U403.7(USBDN3_DP)
USBDN4_DM: B404.4 J402.6(D2-) U403.8(USBDN4_DM)
USBDN4_DP: B404.2 J402.7(D2+) U403.9(USBDN4_DP)
USBH1_DM: U403.30(USBUP_DM) ; port USBH1_DM
USBH1_DP: U403.31(USBUP_DP) ; port USBH1_DP
USBH1_VBUS: R403.2 ; port USBH1_VBUS
USBO_DM: B400.4 J400.2(D-) ; port USBO_DM
USBO_DP: B400.2 J400.3(D+) ; port USBO_DP
USBO_ID: H401.2 J400.4(ID) ; port USBO_ID
USBO_PEN_3V3: U400.1(ENA) U400.4(ENB) ; port USBO_PEN_3V3
USBO_VBUS: R402.2 ; port USBO_VBUS
NetC402_1: C402.1 H401.1 J400.5(GND) L401.2
NetC402_2: C402.2 J400.1(VBUS) L400.2
NetC417_2: C417.2 R409.2 R410.1 U403.26(~{RESET})
NetC419_2: C419.2 C420.2 U403.34(PLLFILT)
NetC421_2: C421.2 C422.2 U403.14(CRFILT)
NetC423_2: C423.2 R414.2 U403.33(XTAL1) X400.1
NetC424_2: C424.2 R414.1 U403.32(XTAL2) X400.2
NetJ401_1: J401.1(VBUS) L402.2
NetJ401_4: J401.4(GND) L404.2
NetJ401_5: J401.5(VBUS2) L403.1
NetJ401_8: J401.8(GND) L405.2
NetJ402_1: J402.1(VBUS) L406.2
NetJ402_4: J402.4(GND) L408.2
NetJ402_5: J402.5(VBUS2) L407.1
NetJ402_8: J402.8(GND) L409.2
NetR404_1: R404.1 R406.1 R411.1 U403.27(VBUS_DET)
NetR407_2: R407.2 R416.1 R418.1 U403.22(SDA/NON_REM1)
NetR408_2: R408.2 R417.1 R419.1 U403.24(SCL/CFG_SEL0)
NetR412_1: R412.1 U403.25(HS_IND/CFG_SEL1)
NetR413_1: R413.1 U403.28(LOCAL_PWR/NON_REM0)
NetR415_2: R415.2 U403.35(RBIAS)

### Notes on the sheet
- 1 [mA] = 10 * U [mV]
- (near R411) I2C: #2C [ 0 1 0 1 1 0 0 RW ]
- Designed By
- Checked By
- Company:
- Size:
- A3
- Address:
- Sheet:
- /

### Library data of the parts
C400 C401 C404-C407 = C+
C402 C403 C408-C415 C417 C419-C424 = C
H401 = H2
L400-L409 = FBEAD
R400-R419 = R
TP400 TP401 = TESTPOINT: as TP100 on sheet [03] - DIMM CON; Component class: TP; Producer: n/a; Assembly type: no component
U400-U402 = MIC2026
X400 = XTAL

## Sheet [07] - RS232.SchDoc
size A3; CompanyName: FPT-FTI copporation; Address1: FPT Building Duy Tan; Address2: Floor 4,; DocumentNumber: 7; SheetNumber: 7; SheetTotal: 13; NameAuthor: Angle Vu
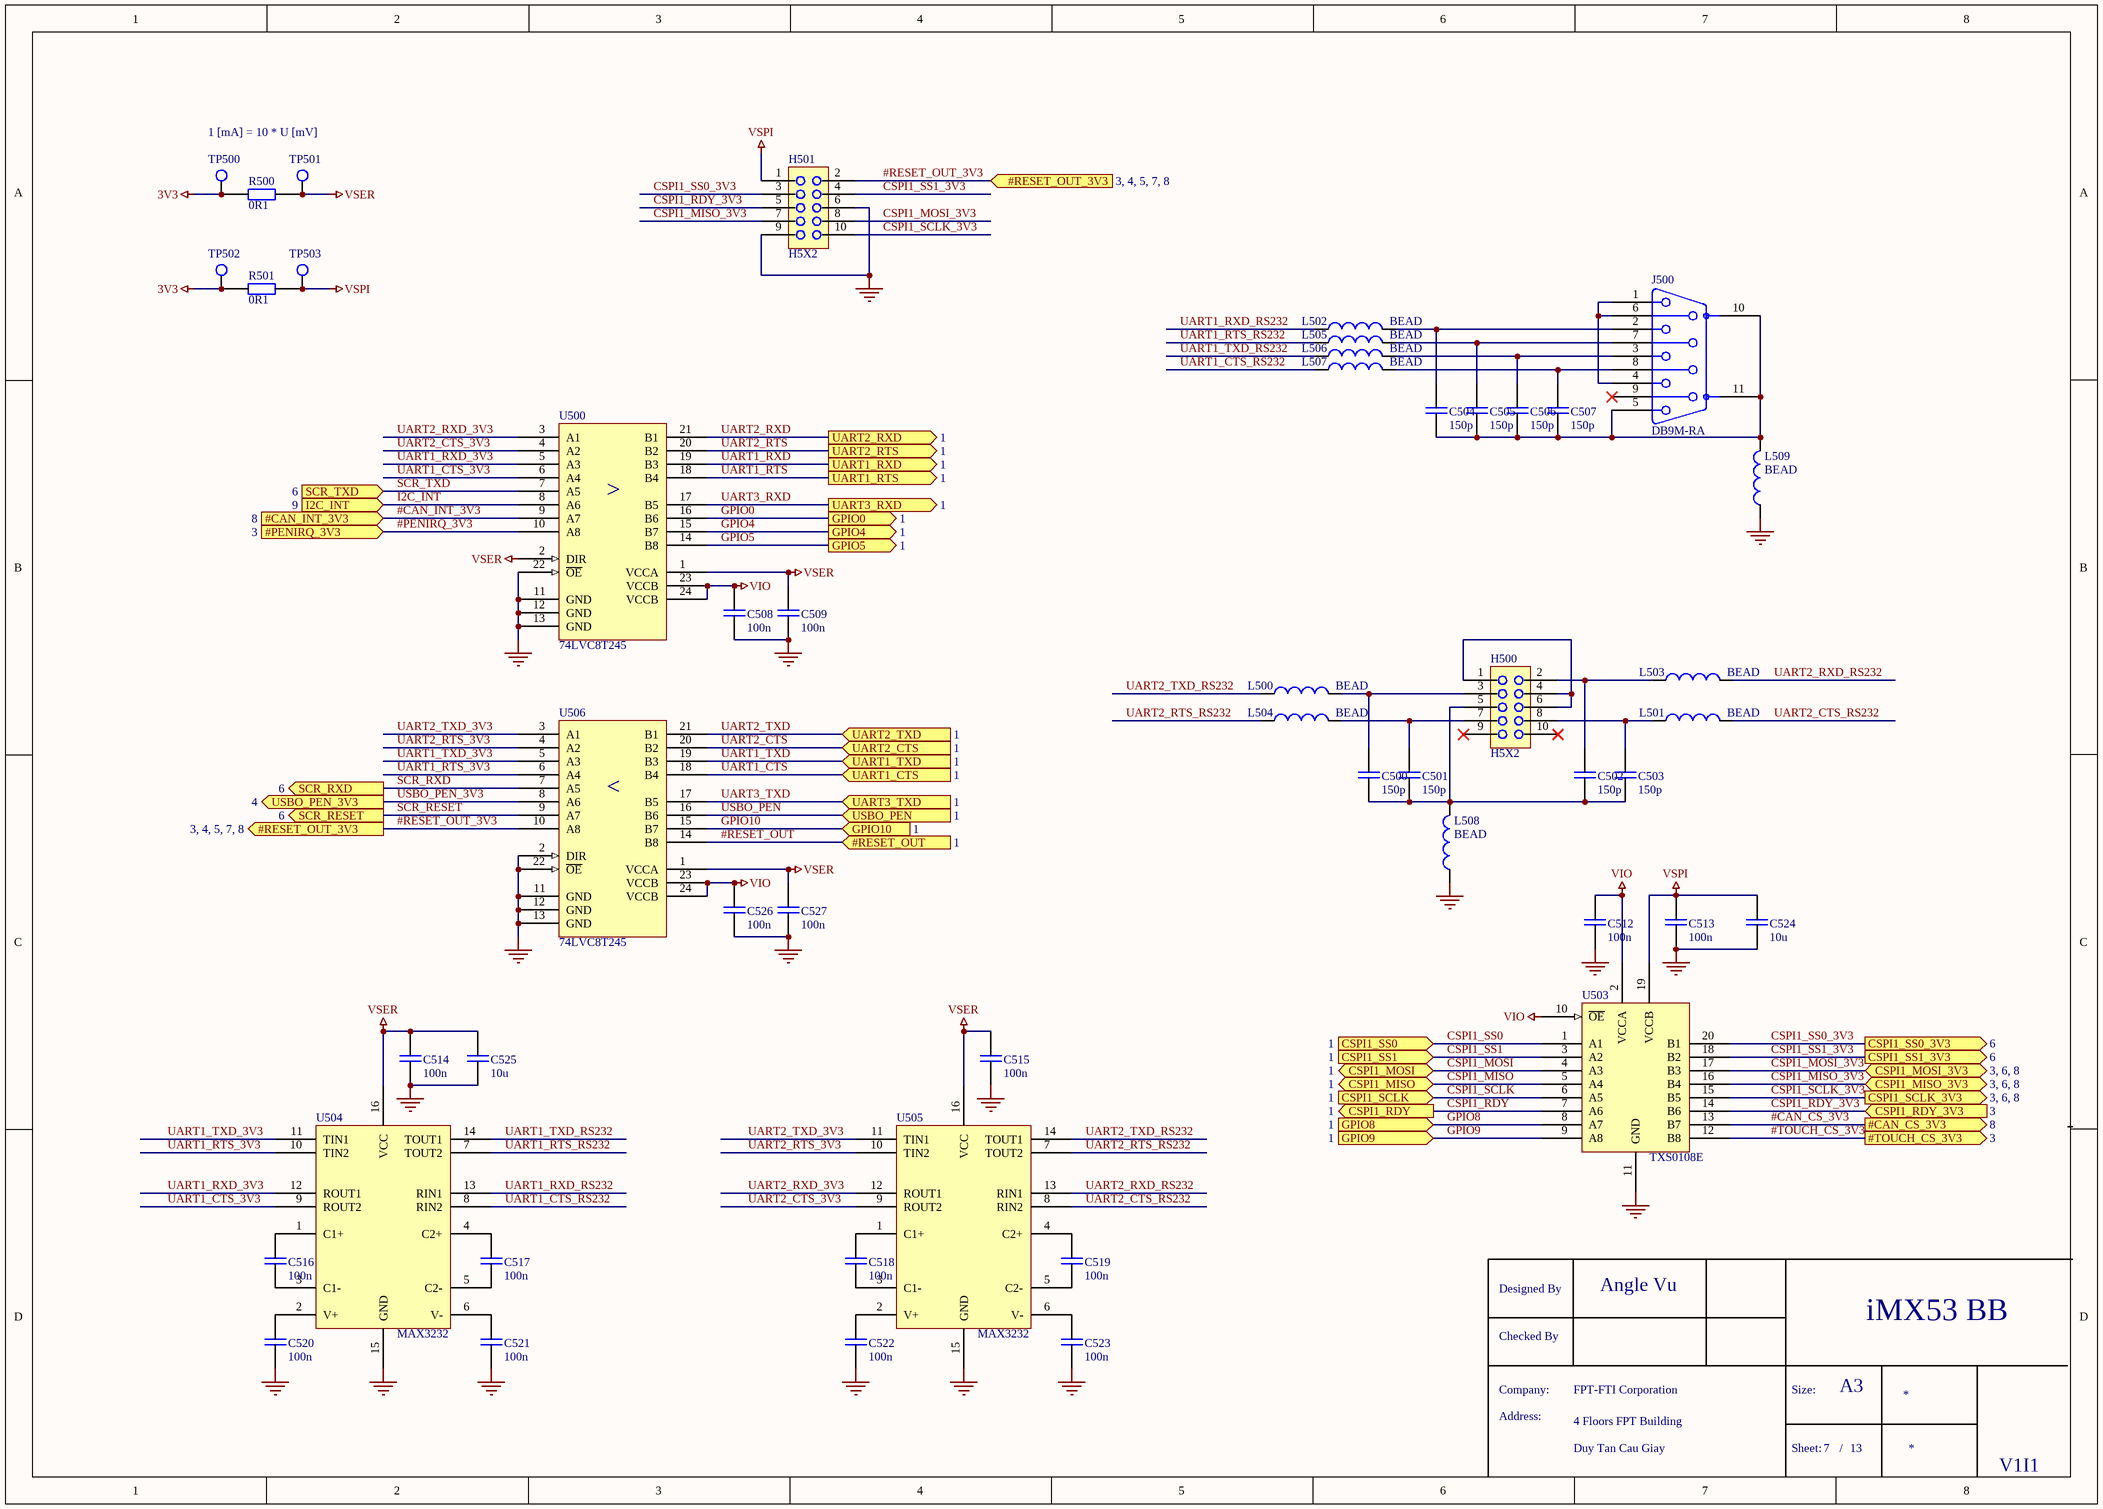
[diagram p7: [07] - RS232.SchDoc]

### Parts
C500  150p  [0603]
C501  150p  [0603]
C502  150p  [0603]
C503  150p  [0603]
C504  150p  [0603]
C505  150p  [0603]
C506  150p  [0603]
C507  150p  [0603]
C508  100n  [0603]
C509  100n  [0603]
C512  100n  [0603]
C513  100n  [0603]
C514  100n  [0603]
C515  100n  [0603]
C516  100n  [0603]
C517  100n  [0603]
C518  100n  [0603]
C519  100n  [0603]
C520  100n  [0603]
C521  100n  [0603]
C522  100n  [0603]
C523  100n  [0603]
C524  10u  [0805]
C525  10u  [0805]
C526  100n  [0603]
C527  100n  [0603]
H500  H5X2  [H2x5]
H501  H5X2  [H2x5]
J500  DB9M-RA  [DRA9_M_RA]
L500  BEAD  [0603]
L501  BEAD  [0603]
L502  BEAD  [0603]
L503  BEAD  [0603]
L504  BEAD  [0603]
L505  BEAD  [0603]
L506  BEAD  [0603]
L507  BEAD  [0603]
L508  BEAD  [0603]
L509  BEAD  [0603]
R500  0R1  [0603]
R501  0R1  [0603]
TP500  TESTPOINT  [TESTPOINT_2mm]  (value not drawn)
TP501  TESTPOINT  [TESTPOINT_2mm]  (value not drawn)
TP502  TESTPOINT  [TESTPOINT_2mm]  (value not drawn)
TP503  TESTPOINT  [TESTPOINT_2mm]  (value not drawn)
U500  74LVC8T245  [TSSOP24]
U503  TXS0108E  [TSSOP20]
U504  MAX3232  [SOIC16N]
U505  MAX3232  [SOIC16N]
U506  74LVC8T245  [TSSOP24]

### Ports
#CAN_CS_3V3 (out, see 8), #CAN_INT_3V3 (in, see 8), #PENIRQ_3V3 (in, see 3), #RESET_OUT (in, see 1), #RESET_OUT_3V3 (in, see 3, 4, 5, 7, 8), #RESET_OUT_3V3 (out, see 3, 4, 5, 7, 8), #TOUCH_CS_3V3 (out, see 3), CSPI1_MISO (bidir, see 1), CSPI1_MISO_3V3 (bidir, see 3, 6, 8), CSPI1_MOSI (bidir, see 1), CSPI1_MOSI_3V3 (bidir, see 3, 6, 8), CSPI1_RDY (out, see 1), CSPI1_RDY_3V3 (in, see 3), CSPI1_SCLK (in, see 1), CSPI1_SCLK_3V3 (out, see 3, 6, 8), CSPI1_SS0 (in, see 1), CSPI1_SS0_3V3 (out, see 6), CSPI1_SS1 (in, see 1), CSPI1_SS1_3V3 (out, see 6), GPIO0 (out, see 1), GPIO4 (out, see 1), GPIO5 (out, see 1), GPIO8 (in, see 1), GPIO9 (in, see 1), GPIO10 (in, see 1), I2C_INT (in, see 9), SCR_RESET (out, see 6), SCR_RXD (out, see 6), SCR_TXD (in, see 6), UART1_CTS (in, see 1), UART1_RTS (out, see 1), UART1_RXD (out, see 1), UART1_TXD (in, see 1), UART2_CTS (in, see 1), UART2_RTS (out, see 1), UART2_RXD (out, see 1), UART2_TXD (in, see 1), UART3_RXD (out, see 1), UART3_TXD (in, see 1), USBO_PEN (in, see 1), USBO_PEN_3V3 (out, see 4)

### Nets
3V3: R500.1 R501.1 TP500.1 TP502.1
GND: C508.1 C509.1 C512.1 C513.1 C514.1 C515.1 C520.1 C521.1 C522.1 C523.1 C524.1 C525.1 C526.1 C527.1 H501.6 H501.9 L508.1 L509.1 U500.11(GND) U500.12(GND) U500.13(GND) U500.22(~{OE}) U503.11(GND) U504.15(GND) U505.15(GND) U506.2(DIR) U506.11(GND) U506.12(GND) U506.13(GND) U506.22(~{OE})
VIO: C508.2 C512.2 C526.2 U500.23(VCCB) U500.24(VCCB) U503.2(VCCA) U503.10(~{OE}) U506.23(VCCB) U506.24(VCCB)
VSER: C509.2 C514.2 C515.2 C525.2 C527.2 R500.2 TP501.1 U500.1(VCCA) U500.2(DIR) U504.16(VCC) U505.16(VCC) U506.1(VCCA)
VSPI: C513.2 C524.2 H501.1 R501.2 TP503.1 U503.19(VCCB)
#CAN_CS_3V3: U503.13(B7) ; port #CAN_CS_3V3
#CAN_INT_3V3: U500.9(A7) ; port #CAN_INT_3V3
#PENIRQ_3V3: U500.10(A8) ; port #PENIRQ_3V3
#RESET_OUT: U506.14(B8) ; port #RESET_OUT
#RESET_OUT_3V3: H501.2 U506.10(A8) ; port #RESET_OUT_3V3
#TOUCH_CS_3V3: U503.12(B8) ; port #TOUCH_CS_3V3
CSPI1_MISO: U503.5(A4) ; port CSPI1_MISO
CSPI1_MISO_3V3: H501.7 U503.16(B4) ; port CSPI1_MISO_3V3
CSPI1_MOSI: U503.4(A3) ; port CSPI1_MOSI
CSPI1_MOSI_3V3: H501.8 U503.17(B3) ; port CSPI1_MOSI_3V3
CSPI1_RDY: U503.7(A6) ; port CSPI1_RDY
CSPI1_RDY_3V3: H501.5 U503.14(B6) ; port CSPI1_RDY_3V3
CSPI1_SCLK: U503.6(A5) ; port CSPI1_SCLK
CSPI1_SCLK_3V3: H501.10 U503.15(B5) ; port CSPI1_SCLK_3V3
CSPI1_SS0: U503.1(A1) ; port CSPI1_SS0
CSPI1_SS0_3V3: H501.3 U503.20(B1) ; port CSPI1_SS0_3V3
CSPI1_SS1: U503.3(A2) ; port CSPI1_SS1
CSPI1_SS1_3V3: H501.4 U503.18(B2) ; port CSPI1_SS1_3V3
GPIO0: U500.16(B6) ; port GPIO0
GPIO4: U500.15(B7) ; port GPIO4
GPIO5: U500.14(B8) ; port GPIO5
GPIO8: U503.8(A7) ; port GPIO8
GPIO9: U503.9(A8) ; port GPIO9
GPIO10: U506.15(B7) ; port GPIO10
I2C_INT: U500.8(A6) ; port I2C_INT
SCR_RESET: U506.9(A7) ; port SCR_RESET
SCR_RXD: U506.7(A5) ; port SCR_RXD
SCR_TXD: U500.7(A5) ; port SCR_TXD
UART1_CTS: U506.18(B4) ; port UART1_CTS
UART1_CTS_3V3: U500.6(A4) U504.9(ROUT2)
UART1_CTS_RS232: L507.1 U504.8(RIN2)
UART1_RTS: U500.18(B4) ; port UART1_RTS
UART1_RTS_3V3: U504.10(TIN2) U506.6(A4)
UART1_RTS_RS232: L505.1 U504.7(TOUT2)
UART1_RXD: U500.19(B3) ; port UART1_RXD
UART1_RXD_3V3: U500.5(A3) U504.12(ROUT1)
UART1_RXD_RS232: L502.1 U504.13(RIN1)
UART1_TXD: U506.19(B3) ; port UART1_TXD
UART1_TXD_3V3: U504.11(TIN1) U506.5(A3)
UART1_TXD_RS232: L506.1 U504.14(TOUT1)
UART2_CTS: U506.20(B2) ; port UART2_CTS
UART2_CTS_3V3: U500.4(A2) U505.9(ROUT2)
UART2_CTS_RS232: L501.2 U505.8(RIN2)
UART2_RTS: U500.20(B2) ; port UART2_RTS
UART2_RTS_3V3: U505.10(TIN2) U506.4(A2)
UART2_RTS_RS232: L504.1 U505.7(TOUT2)
UART2_RXD: U500.21(B1) ; port UART2_RXD
UART2_RXD_3V3: U500.3(A1) U505.12(ROUT1)
UART2_RXD_RS232: L503.2 U505.13(RIN1)
UART2_TXD: U506.21(B1) ; port UART2_TXD
UART2_TXD_3V3: U505.11(TIN1) U506.3(A1)
UART2_TXD_RS232: L500.1 U505.14(TOUT1)
UART3_RXD: U500.17(B5) ; port UART3_RXD
UART3_TXD: U506.17(B5) ; port UART3_TXD
USBO_PEN: U506.16(B6) ; port USBO_PEN
USBO_PEN_3V3: U506.8(A6) ; port USBO_PEN_3V3
NetC500_1: C500.1 C501.1 C502.1 C503.1 H500.5 L508.2
NetC500_2: C500.2 H500.3 L500.2
NetC501_2: C501.2 H500.7 L504.2
NetC502_2: C502.2 H500.2 L503.1
NetC503_2: C503.2 H500.8 L501.1
NetC504_1: C504.1 C505.1 C506.1 C507.1 J500.5 J500.10(SHIELD) J500.11(SHIELD) L509.2
NetC504_2: C504.2 J500.2 L502.2
NetC505_2: C505.2 J500.7 L505.2
NetC506_2: C506.2 J500.3 L506.2
NetC507_2: C507.2 J500.8 L507.2
NetC516_1: C516.1 U504.3(C1-)
NetC516_2: C516.2 U504.1(C1+)
NetC517_1: C517.1 U504.5(C2-)
NetC517_2: C517.2 U504.4(C2+)
NetC518_1: C518.1 U505.3(C1-)
NetC518_2: C518.2 U505.1(C1+)
NetC519_1: C519.1 U505.5(C2-)
NetC519_2: C519.2 U505.4(C2+)
NetC520_2: C520.2 U504.2(V+)
NetC521_2: C521.2 U504.6(V-)
NetC522_2: C522.2 U505.2(V+)
NetC523_2: C523.2 U505.6(V-)
NetH500_1: H500.1 H500.4 H500.6
NetJ500_1: J500.1 J500.4 J500.6

Not connected (* = marked no-connect by the designer): H500 9* 10*; J500 9(17)*

### Notes on the sheet
- 1 [mA] = 10 * U [mV]
- (near U500) >
- (near U506) <
- Designed By
- Checked By
- Company:
- Size:
- A3
- Address:
- Sheet:
- /

### Library data of the parts
C500-C509 C512-C527 = C
L500-L509 = FBEAD
R500 R501 = R
TP500-TP503 = TESTPOINT: as TP100 on sheet [03] - DIMM CON; Component class: TP; Producer: n/a; Assembly type: no component